# EAGLE design NOMIDI_Controller_001 (EAGLE 9.6.2)
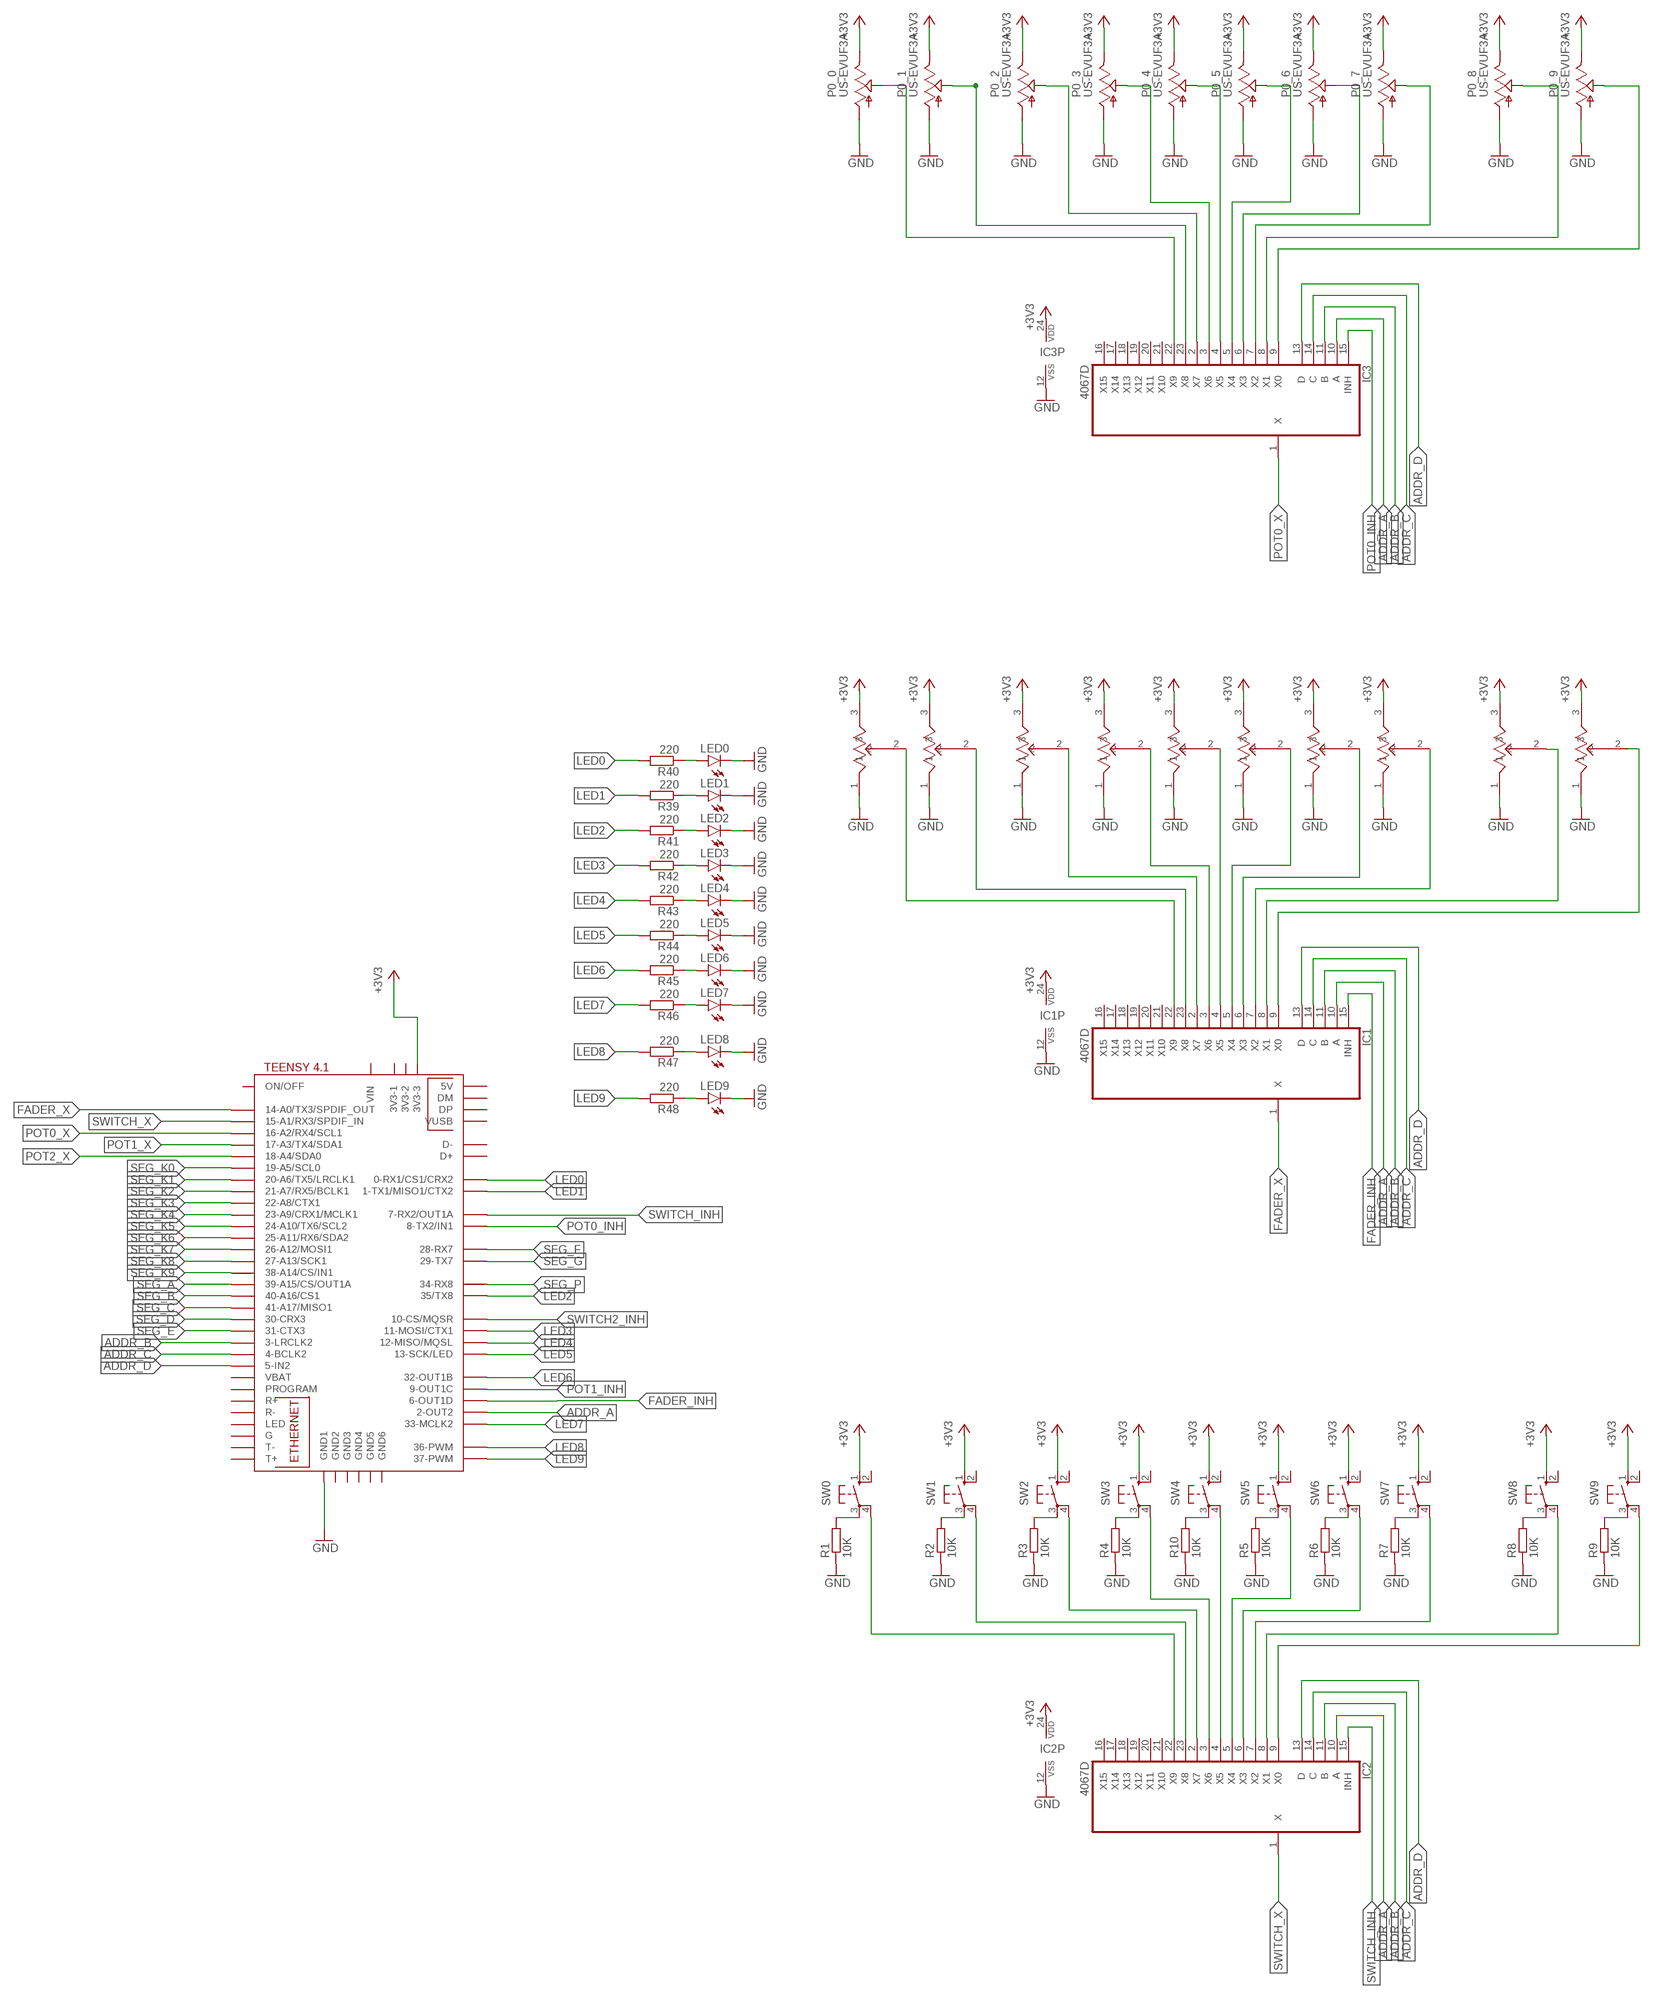
[diagram p0: schematic, sheet 1, part 1 of 3]
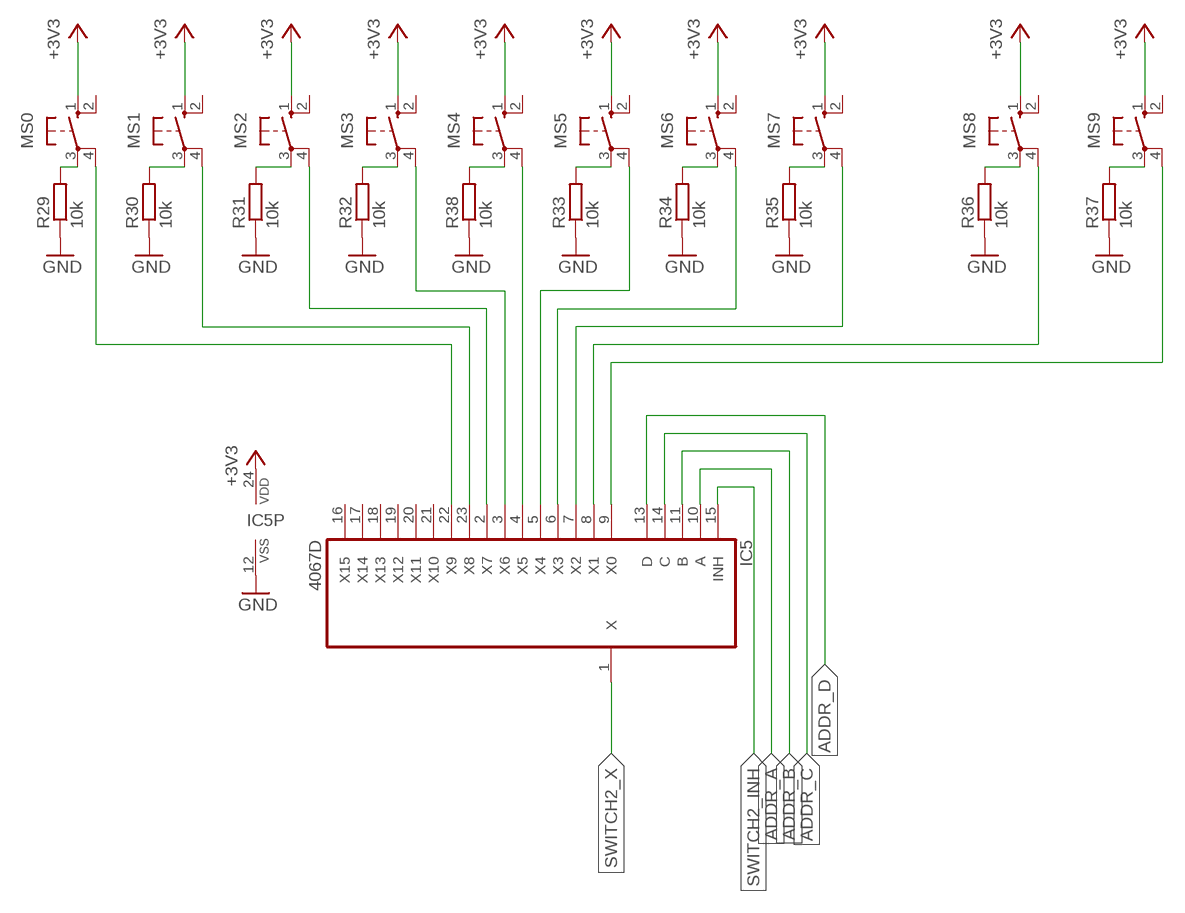
[diagram p1: schematic, sheet 1, part 2 of 3]
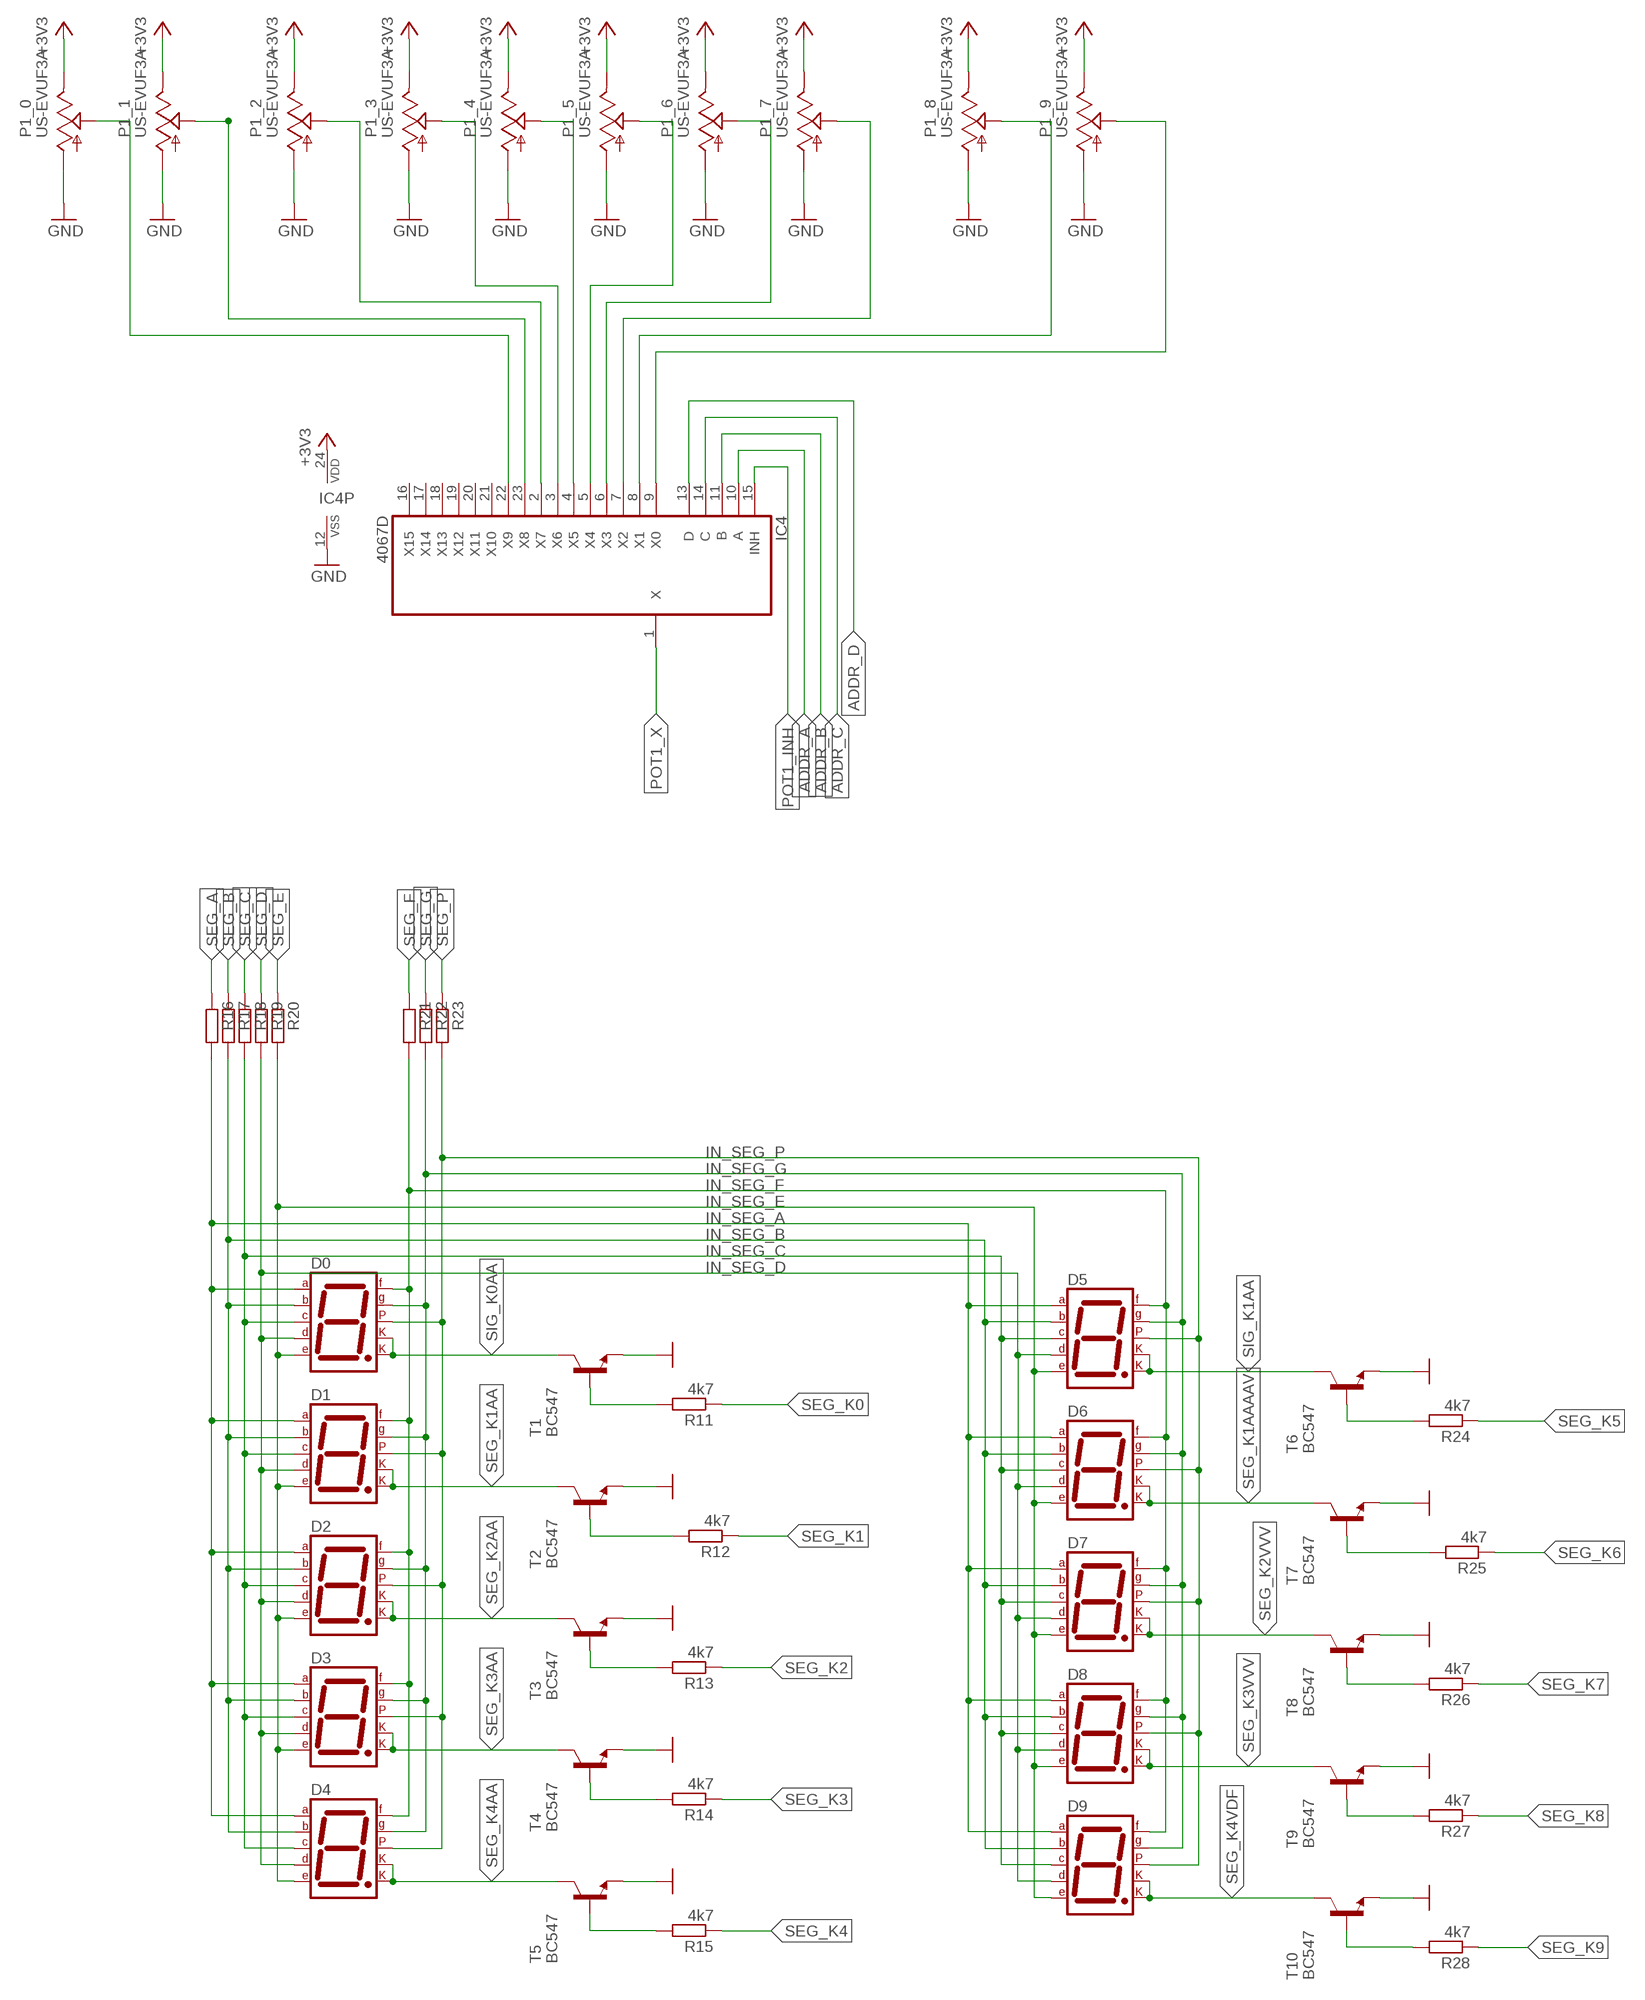
[diagram p2: schematic, sheet 1, part 3 of 3]

## Parts
D0  7SEG-CK  [7SEG-13]
D1  7SEG-CK  [7SEG-13]
D2  7SEG-CK  [7SEG-13]
D3  7SEG-CK  [7SEG-13]
D4  7SEG-CK  [7SEG-13]
D5  7SEG-CK  [7SEG-13]
D6  7SEG-CK  [7SEG-13]
D7  7SEG-CK  [7SEG-13]
D8  7SEG-CK  [7SEG-13]
D9  7SEG-CK  [7SEG-13]
IC1  4067D  [SO24W]
IC2  4067D  [SO24W]
IC3  4067D  [SO24W]
IC4  4067D  [SO24W]
IC5  4067D  [SO24W]
LED0  LED3MM  [LED3MM]
LED1  LED3MM  [LED3MM]
LED2  LED3MM  [LED3MM]
LED3  LED3MM  [LED3MM]
LED4  LED3MM  [LED3MM]
LED5  LED3MM  [LED3MM]
LED6  LED3MM  [LED3MM]
LED7  LED3MM  [LED3MM]
LED8  LED3MM  [LED3MM]
LED9  LED3MM  [LED3MM]
M0  SLIDEPOT-ALPS-60MM  [RS6011SP600]
M1  SLIDEPOT-ALPS-60MM  [RS6011SP600]
MS0  10-XX  [B3F-10XX]
MS1  10-XX  [B3F-10XX]
MS2  10-XX  [B3F-10XX]
MS3  10-XX  [B3F-10XX]
MS4  10-XX  [B3F-10XX]
MS5  10-XX  [B3F-10XX]
MS6  10-XX  [B3F-10XX]
MS7  10-XX  [B3F-10XX]
MS8  10-XX  [B3F-10XX]
MS9  10-XX  [B3F-10XX]
P0_0  US-EVUF3A  [EVUF]
P0_1  US-EVUF3A  [EVUF]
P0_2  US-EVUF3A  [EVUF]
P0_3  US-EVUF3A  [EVUF]
P0_4  US-EVUF3A  [EVUF]
P0_5  US-EVUF3A  [EVUF]
P0_6  US-EVUF3A  [EVUF]
P0_7  US-EVUF3A  [EVUF]
P0_8  US-EVUF3A  [EVUF]
P0_9  US-EVUF3A  [EVUF]
P1_0  US-EVUF3A  [EVUF]
P1_1  US-EVUF3A  [EVUF]
P1_2  US-EVUF3A  [EVUF]
P1_3  US-EVUF3A  [EVUF]
P1_4  US-EVUF3A  [EVUF]
P1_5  US-EVUF3A  [EVUF]
P1_6  US-EVUF3A  [EVUF]
P1_7  US-EVUF3A  [EVUF]
P1_8  US-EVUF3A  [EVUF]
P1_9  US-EVUF3A  [EVUF]
R1  10K  R-EU_0207/7  [0207/7]
R2  10K  R-EU_0207/7  [0207/7]
R3  10K  R-EU_0207/7  [0207/7]
R4  10K  R-EU_0207/7  [0207/7]
R5  10K  R-EU_0207/7  [0207/7]
R6  10K  R-EU_0207/7  [0207/7]
R7  10K  R-EU_0207/7  [0207/7]
R8  10K  R-EU_0207/7  [0207/7]
R9  10K  R-EU_0207/7  [0207/7]
R10  10K  R-EU_0207/7  [0207/7]
R11  4k7  R-EU_0207/7  [0207/7]
R12  4k7  R-EU_0207/7  [0207/7]
R13  4k7  R-EU_0207/7  [0207/7]
R14  4k7  R-EU_0207/7  [0207/7]
R15  4k7  R-EU_0207/7  [0207/7]
R16  R-EU_0207/7  [0207/7]
R17  R-EU_0207/7  [0207/7]
R18  R-EU_0207/7  [0207/7]
R19  R-EU_0207/7  [0207/7]
R20  R-EU_0207/7  [0207/7]
R21  R-EU_0207/7  [0207/7]
R22  R-EU_0207/7  [0207/7]
R23  R-EU_0207/7  [0207/7]
R24  4k7  R-EU_0207/7  [0207/7]
R25  4k7  R-EU_0207/7  [0207/7]
R26  4k7  R-EU_0207/7  [0207/7]
R27  4k7  R-EU_0207/7  [0207/7]
R28  4k7  R-EU_0207/7  [0207/7]
R29  10k  R-EU_0207/7  [0207/7]
R30  10k  R-EU_0207/7  [0207/7]
R31  10k  R-EU_0207/7  [0207/7]
R32  10k  R-EU_0207/7  [0207/7]
R33  10k  R-EU_0207/7  [0207/7]
R34  10k  R-EU_0207/7  [0207/7]
R35  10k  R-EU_0207/7  [0207/7]
R36  10k  R-EU_0207/7  [0207/7]
R37  10k  R-EU_0207/7  [0207/7]
R38  10k  R-EU_0207/7  [0207/7]
R39  220  R-EU_0207/7  [0207/7]
R40  220  R-EU_0207/7  [0207/7]
R41  220  R-EU_0207/7  [0207/7]
R42  220  R-EU_0207/7  [0207/7]
R43  220  R-EU_0207/7  [0207/7]
R44  220  R-EU_0207/7  [0207/7]
R45  220  R-EU_0207/7  [0207/7]
R46  220  R-EU_0207/7  [0207/7]
R47  220  R-EU_0207/7  [0207/7]
R48  220  R-EU_0207/7  [0207/7]
S0  SLIDEPOT-ALPS-60MM  [RS6011SP600]
S1  SLIDEPOT-ALPS-60MM  [RS6011SP600]
S2  SLIDEPOT-ALPS-60MM  [RS6011SP600]
S3  SLIDEPOT-ALPS-60MM  [RS6011SP600]
S4  SLIDEPOT-ALPS-60MM  [RS6011SP600]
S5  SLIDEPOT-ALPS-60MM  [RS6011SP600]
S6  SLIDEPOT-ALPS-60MM  [RS6011SP600]
S7  SLIDEPOT-ALPS-60MM  [RS6011SP600]
SW0  10-XX  [B3F-10XX]
SW1  10-XX  [B3F-10XX]
SW2  10-XX  [B3F-10XX]
SW3  10-XX  [B3F-10XX]
SW4  10-XX  [B3F-10XX]
SW5  10-XX  [B3F-10XX]
SW6  10-XX  [B3F-10XX]
SW7  10-XX  [B3F-10XX]
SW8  10-XX  [B3F-10XX]
SW9  10-XX  [B3F-10XX]
T1  BC547  [TO92]
T2  BC547  [TO92]
T3  BC547  [TO92]
T4  BC547  [TO92]
T5  BC547  [TO92]
T6  BC547  [TO92]
T7  BC547  [TO92]
T8  BC547  [TO92]
T9  BC547  [TO92]
T10  BC547  [TO92]
U$1  TEENSY41  [TEENSY41]

## Nets
+3V3: IC1.24(VDD) IC2.24(VDD) IC3.24(VDD) IC4.24(VDD) IC5.24(VDD) M0.3 M1.3 MS0.1(S) MS1.1(S) MS2.1(S) MS3.1(S) MS4.1(S) MS5.1(S) MS6.1(S) MS7.1(S) MS8.1(S) MS9.1(S) P0_0.3(E) P0_1.3(E) P0_2.3(E) P0_3.3(E) P0_4.3(E) P0_5.3(E) P0_6.3(E) P0_7.3(E) P0_8.3(E) P0_9.3(E) P1_0.3(E) P1_1.3(E) P1_2.3(E) P1_3.3(E) P1_4.3(E) P1_5.3(E) P1_6.3(E) P1_7.3(E) P1_8.3(E) P1_9.3(E) S0.3 S1.3 S2.3 S3.3 S4.3 S5.3 S6.3 S7.3 SW0.1(S) SW1.1(S) SW2.1(S) SW3.1(S) SW4.1(S) SW5.1(S) SW6.1(S) SW7.1(S) SW8.1(S) SW9.1(S) U$1.3V3-3
ADDR_A: IC1.10(A) IC2.10(A) IC3.10(A) IC4.10(A) IC5.10(A) U$1.2-OUT2
ADDR_B: IC1.11(B) IC2.11(B) IC3.11(B) IC4.11(B) IC5.11(B) U$1.3-LRCLK2
ADDR_C: IC1.14(C) IC2.14(C) IC3.14(C) IC4.14(C) IC5.14(C) U$1.4-BCLK2
ADDR_D: IC1.13(D) IC2.13(D) IC3.13(D) IC4.13(D) IC5.13(D) U$1.5-IN2
FADER_INH: IC1.15(INH) U$1.6-OUT1D
FADER_X: IC1.1(X) U$1.14-A0/TX3/SPDIF_OUT
GND: IC1.12(VSS) IC2.12(VSS) IC3.12(VSS) IC4.12(VSS) IC5.12(VSS) LED0.K(C) LED1.K(C) LED2.K(C) LED3.K(C) LED4.K(C) LED5.K(C) LED6.K(C) LED7.K(C) LED8.K(C) LED9.K(C) M0.1 M1.1 P0_0.1(A) P0_1.1(A) P0_2.1(A) P0_3.1(A) P0_4.1(A) P0_5.1(A) P0_6.1(A) P0_7.1(A) P0_8.1(A) P0_9.1(A) P1_0.1(A) P1_1.1(A) P1_2.1(A) P1_3.1(A) P1_4.1(A) P1_5.1(A) P1_6.1(A) P1_7.1(A) P1_8.1(A) P1_9.1(A) R1.1 R2.1 R3.1 R4.1 R5.1 R6.1 R7.1 R8.1 R9.1 R10.1 R29.1 R30.1 R31.1 R32.1 R33.1 R34.1 R35.1 R36.1 R37.1 R38.1 S0.1 S1.1 S2.1 S3.1 S4.1 S5.1 S6.1 S7.1 T1.1(E) T2.1(E) T3.1(E) T4.1(E) T5.1(E) T6.1(E) T7.1(E) T8.1(E) T9.1(E) T10.1(E) U$1.GND1
IN_SEG_A: D0.7(A) D1.7(A) D2.7(A) D3.7(A) D4.7(A) D5.7(A) D6.7(A) D7.7(A) D8.7(A) D9.7(A) R16.2
IN_SEG_B: D0.6(B) D1.6(B) D2.6(B) D3.6(B) D4.6(B) D5.6(B) D6.6(B) D7.6(B) D8.6(B) D9.6(B) R17.2
IN_SEG_C: D0.4(C) D1.4(C) D2.4(C) D3.4(C) D4.4(C) D5.4(C) D6.4(C) D7.4(C) D8.4(C) D9.4(C) R18.2
IN_SEG_D: D0.2(D) D1.2(D) D2.2(D) D3.2(D) D4.2(D) D5.2(D) D6.2(D) D7.2(D) D8.2(D) D9.2(D) R19.2
IN_SEG_E: D0.1(E) D1.1(E) D2.1(E) D3.1(E) D4.1(E) D5.1(E) D6.1(E) D7.1(E) D8.1(E) D9.1(E) R20.2
IN_SEG_F: D0.9(F) D1.9(F) D2.9(F) D3.9(F) D4.9(F) D5.9(F) D6.9(F) D7.9(F) D8.9(F) D9.9(F) R21.2
IN_SEG_G: D0.10(G) D1.10(G) D2.10(G) D3.10(G) D4.10(G) D5.10(G) D6.10(G) D7.10(G) D8.10(G) D9.10(G) R22.2
IN_SEG_P: D0.5(DP) D1.5(DP) D2.5(DP) D3.5(DP) D4.5(DP) D5.5(DP) D6.5(DP) D7.5(DP) D8.5(DP) D9.5(DP) R23.2
LED0: R40.2 U$1.0-RX1/CS1/CRX2
LED1: R39.2 U$1.1-TX1/MISO1/CTX2
LED2: R41.2 U$1.35-TX8(35/TX8)
LED3: R42.2 U$1.11-MOSI/CTX1
LED4: R43.2 U$1.12-MISO/MQSL
LED5: R44.2 U$1.13-SCK/LED
LED6: R45.2 U$1.32-OUT1B
LED7: R46.2 U$1.33-MCLK2
LED8: R47.2 U$1.36-PWM
LED9: R48.2 U$1.37-PWM
N$1: IC1.22(X9) S0.2
N$2: IC1.9(X0) M1.2
N$3: IC1.8(X1) M0.2
N$4: IC2.9(X0) SW9.4(P1)
N$5: IC1.7(X2) S7.2
N$6: IC1.6(X3) S6.2
N$7: IC1.5(X4) S5.2
N$8: IC1.4(X5) S4.2
N$9: IC1.3(X6) S3.2
N$10: IC1.2(X7) S2.2
N$11: IC1.23(X8) S1.2
N$12: IC2.8(X1) SW8.4(P1)
N$13: IC2.7(X2) SW7.4(P1)
N$14: IC2.6(X3) SW6.4(P1)
N$15: IC2.5(X4) SW5.4(P1)
N$16: IC3.9(X0) P0_9.2(S)
N$17: IC2.3(X6) SW3.4(P1)
N$18: IC2.2(X7) SW2.4(P1)
N$19: IC2.23(X8) SW1.4(P1)
N$20: IC2.22(X9) SW0.4(P1)
N$21: R1.2 SW0.3(P)
N$22: R2.2 SW1.3(P)
N$23: IC3.8(X1) P0_8.2(S)
N$24: R3.2 SW2.3(P)
N$25: IC3.7(X2) P0_7.2(S)
N$26: R4.2 SW3.3(P)
N$27: IC3.6(X3) P0_6.2(S)
N$28: R5.2 SW5.3(P)
N$29: IC3.5(X4) P0_5.2(S)
N$30: R6.2 SW6.3(P)
N$31: IC3.4(X5) P0_4.2(S)
N$32: R7.2 SW7.3(P)
N$33: IC3.3(X6) P0_3.2(S)
N$34: R8.2 SW8.3(P)
N$35: IC3.2(X7) P0_2.2(S)
N$36: R9.2 SW9.3(P)
N$37: IC2.4(X5) SW4.4(P1)
N$38: R10.2 SW4.3(P)
N$39: IC3.23(X8) P0_1.2(S)
N$40: IC3.22(X9) P0_0.2(S)
N$41: IC4.9(X0) P1_9.2(S)
N$42: IC4.8(X1) P1_8.2(S)
N$43: IC4.7(X2) P1_7.2(S)
N$44: IC4.6(X3) P1_6.2(S)
N$45: IC4.5(X4) P1_5.2(S)
N$46: IC4.4(X5) P1_4.2(S)
N$47: IC4.3(X6) P1_3.2(S)
N$48: IC4.2(X7) P1_2.2(S)
N$49: IC4.23(X8) P1_1.2(S)
N$50: IC4.22(X9) P1_0.2(S)
N$51: R11.2 T1.2(B)
N$52: R12.2 T2.2(B)
N$53: IC5.9(X0) MS9.4(P1)
N$54: R13.2 T3.2(B)
N$55: R14.2 T4.2(B)
N$56: R15.2 T5.2(B)
N$57: IC5.8(X1) MS8.4(P1)
N$58: IC5.7(X2) MS7.4(P1)
N$59: IC5.6(X3) MS6.4(P1)
N$60: IC5.5(X4) MS5.4(P1)
N$61: IC5.3(X6) MS3.4(P1)
N$62: IC5.2(X7) MS2.4(P1)
N$63: IC5.23(X8) MS1.4(P1)
N$64: R24.2 T6.2(B)
N$65: R25.2 T7.2(B)
N$66: R26.2 T8.2(B)
N$67: R27.2 T9.2(B)
N$68: R28.2 T10.2(B)
N$69: IC5.22(X9) MS0.4(P1)
N$70: MS0.3(P) R29.2
N$71: MS1.3(P) R30.2
N$72: MS2.3(P) R31.2
N$73: MS3.3(P) R32.2
N$74: MS5.3(P) R33.2
N$75: MS6.3(P) R34.2
N$76: MS7.3(P) R35.2
N$77: MS8.3(P) R36.2
N$78: MS9.3(P) R37.2
N$79: IC5.4(X5) MS4.4(P1)
N$80: MS4.3(P) R38.2
N$81: LED2.A R41.1
N$82: LED0.A R40.1
N$83: LED3.A R42.1
N$84: LED1.A R39.1
N$85: LED4.A R43.1
N$86: LED5.A R44.1
N$87: LED6.A R45.1
N$88: LED7.A R46.1
N$89: LED8.A R47.1
N$90: LED9.A R48.1
POT0_INH: IC3.15(INH) U$1.8-TX2/IN1
POT0_X: IC3.1(X) U$1.16-A2/RX4/SCL1
POT1_INH: IC4.15(INH) U$1.9-OUT1C
POT1_X: IC4.1(X) U$1.17-A3/TX4/SDA1
POT2_X: U$1.18-A4/SDA0
SEG_A: R16.1 U$1.39-A15/CS/OUT1A
SEG_B: R17.1 U$1.40-A16/CS1
SEG_C: R18.1 U$1.41-A17/MISO1
SEG_D: R19.1 U$1.30-CRX3
SEG_E: R20.1 U$1.31-CTX3
SEG_F: R21.1 U$1.28-RX7
SEG_G: R22.1 U$1.29-TX7
SEG_K0: R11.1 U$1.19-A5/SCL0
SEG_K1: R12.1 U$1.20-A6/TX5/LRCLK1
SEG_K1AA: D1.3(CK1) D1.8(CK2) T2.3(C)
SEG_K1AAAAV: D6.3(CK1) D6.8(CK2) T7.3(C)
SEG_K2: R13.1 U$1.21-A7/RX5/BCLK1
SEG_K2AA: D2.3(CK1) D2.8(CK2) T3.3(C)
SEG_K2VVV: D7.3(CK1) D7.8(CK2) T8.3(C)
SEG_K3: R14.1 U$1.22-A8/CTX1
SEG_K3AA: D3.3(CK1) D3.8(CK2) T4.3(C)
SEG_K3VVV: D8.3(CK1) D8.8(CK2) T9.3(C)
SEG_K4: R15.1 U$1.23-A9/CRX1/MCLK1
SEG_K4AA: D4.3(CK1) D4.8(CK2) T5.3(C)
SEG_K4VDF: D9.3(CK1) D9.8(CK2) T10.3(C)
SEG_K5: R24.1 U$1.24-A10/TX6/SCL2
SEG_K6: R25.1 U$1.25-A11/RX6/SDA2
SEG_K7: R26.1 U$1.26-A12/MOSI1
SEG_K8: R27.1 U$1.27-A13/SCK1
SEG_K9: R28.1 U$1.38-A14/CS/IN1
SEG_P: R23.1 U$1.34-RX8
SIG_K0AA: D0.3(CK1) D0.8(CK2) T1.3(C)
SIG_K1AA: D5.3(CK1) D5.8(CK2) T6.3(C)
SWITCH2_INH: IC5.15(INH) U$1.10-CS\MQSR(10-CS/MQSR)
SWITCH2_X: IC5.1(X)
SWITCH_INH: IC2.15(INH) U$1.7-RX2/OUT1A
SWITCH_X: IC2.1(X) U$1.15-A1/RX3/SPDIF_IN
Unconnected: IC1.16(X15) IC1.17(X14) IC1.18(X13) IC1.19(X12) IC1.20(X11) IC1.21(X10) IC2.16(X15) IC2.17(X14) IC2.18(X13) IC2.19(X12) IC2.20(X11) IC2.21(X10) IC3.16(X15) IC3.17(X14) IC3.18(X13) IC3.19(X12) IC3.20(X11) IC3.21(X10) IC4.16(X15) IC4.17(X14) IC4.18(X13) IC4.19(X12) IC4.20(X11) IC4.21(X10) IC5.16(X15) IC5.17(X14) IC5.18(X13) IC5.19(X12) IC5.20(X11) IC5.21(X10) MS0.2(S1) MS1.2(S1) MS2.2(S1) MS3.2(S1) MS4.2(S1) MS5.2(S1) MS6.2(S1) MS7.2(S1) MS8.2(S1) MS9.2(S1) SW0.2(S1) SW1.2(S1) SW2.2(S1) SW3.2(S1) SW4.2(S1) SW5.2(S1) SW6.2(S1) SW7.2(S1) SW8.2(S1) SW9.2(S1) U$1.3V3-1 U$1.3V3-2 U$1.+5V(5V) U$1.D+ U$1.D- U$1.DM U$1.DP U$1.G U$1.GND2 U$1.GND3 U$1.GND4 U$1.GND5 U$1.GND6 U$1.LED U$1.ON/OFF U$1.PROGRAM U$1.R+ U$1.R- U$1.T+ U$1.T- U$1.VBAT U$1.VIN U$1.VUSB

## Library data of the parts
D0 D1-D9 = special:7SEG-CK: 7-segment DISPLAY single cathode, 13 mm
IC1-IC5 = 40xx:4067: 16-channel ANALOG MULTIPLEXER
LED0 LED1-LED9 = led:LED: LED OSRAM: - CHIPLED LG R971, LG N971, LY N971, LG Q971, LY Q971, LO R971, LY R971 LH N974, LH R974 LS Q976, LO Q976, LY Q976 LO Q996 - Hyper CHIPLED LW Q18S LB Q993, LB Q99A, LB R99A - SideLED LS A670, LO A670, LY A670, LG A670, LP A670 LB A673, LV A673, LT A673, LW A673 LH A674 LY A675 LS A676, LA A676, LO A676, LY A676, LW A676 LS A679, LY A679, LG A679 - Hyper Micro SIDELED® LS Y876, LA Y876, LO Y876, LY Y876 LT Y87S - SmartLED LW L88C, LW L88S LB L89C, LB L89S, LG L890 LS L89K, LO L89K, LY L89K LS L896, LA L896, LO L896, LY L896 - TOPLED LS T670, LO T670, LY T670, LG T670, LP T670 LSG T670, LSP T670, LSY T670, LOP T670, LYG T670 LG T671, LOG T671, LSG T671 LB T673, LV T673, LT T673, LW T673 LH T674 LS T676, LA T676, LO T676, LY T676, LB T676, LH T676, LSB T676, LW T676 LB T67C, LV T67C, LT T67C, LS T67K, LO T67K, LY T67K, LW E67C LS E67B, LA E67B, LO E67B, LY E67B, LB E67C, LV E67C, LT E67C LW T67C LS T679, LY T679, LG T679 LS T770, LO T770, LY T770, LG T770, LP T770 LB T773, LV T773, LT T773, LW T773 LH T774 LS E675, LA E675, LY E675, LS T675 LS T776, LA T776, LO T776, LY T776, LB T776 LHGB T686 LT T68C, LB T68C - Hyper Mini TOPLED® LB M676 - Mini TOPLED Santana® LG M470 LS M47K, LO M47K, LY M47K Source: http://www.osram.convergy.de LUXEON: - LUMILED® LXK2-PW12-R00, LXK2-PW12-S00, LXK2-PW14-U00, LXK2-PW14-V00 LXK2-PM12-R00, LXK2-PM12-S00, LXK2-PM14-U00 LXK2-PE12-Q00, LXK2-PE12-R00, LXK2-PE12-S00, LXK2-PE14-T00, LXK2-PE14-U00 LXK2-PB12-K00, LXK2-PB12-L00, LXK2-PB12-M00, LXK2-PB14-N00, LXK2-PB14-P00, LXK2-PB14-Q00 LXK2-PR12-L00, LXK2-PR12-M00, LXK2-PR14-Q00, LXK2-PR14-R00 LXK2-PD12-Q00, LXK2-PD12-R00, LXK2-PD12-S00 LXK2-PH12-R00, LXK2-PH12-S00 LXK2-PL12-P00, LXK2-PL12-Q00, LXK2-PL12-R00 Source: www.luxeon.com KINGBRIGHT: KA-3528ASYC Source: www.kingbright.com
M0 M1 S0 S1-S7 = monome:SLIDEPOT-ALPS-60MM
MS0 MS1-MS9 SW0 SW1-SW9 = switch-omron:10-XX: OMRON SWITCH; MPN: B3F-1000; OC_FARNELL: 176432; OC_NEWARK: 36M3542
P0_0 P0_1-P0_9 P1_0 P1_1-P1_9 = pot:US-EVU: 9 mm Square Rotary Potentiometers Source: Panasonic
R1-R48 = rcl:R-EU_: RESISTOR, European symbol; SPICEPREFIX: R
T1-T10 = transistor-neu-to92:BC547: NPN TRANSISTOR
U$1 = teensy:TEENSY41

## Board
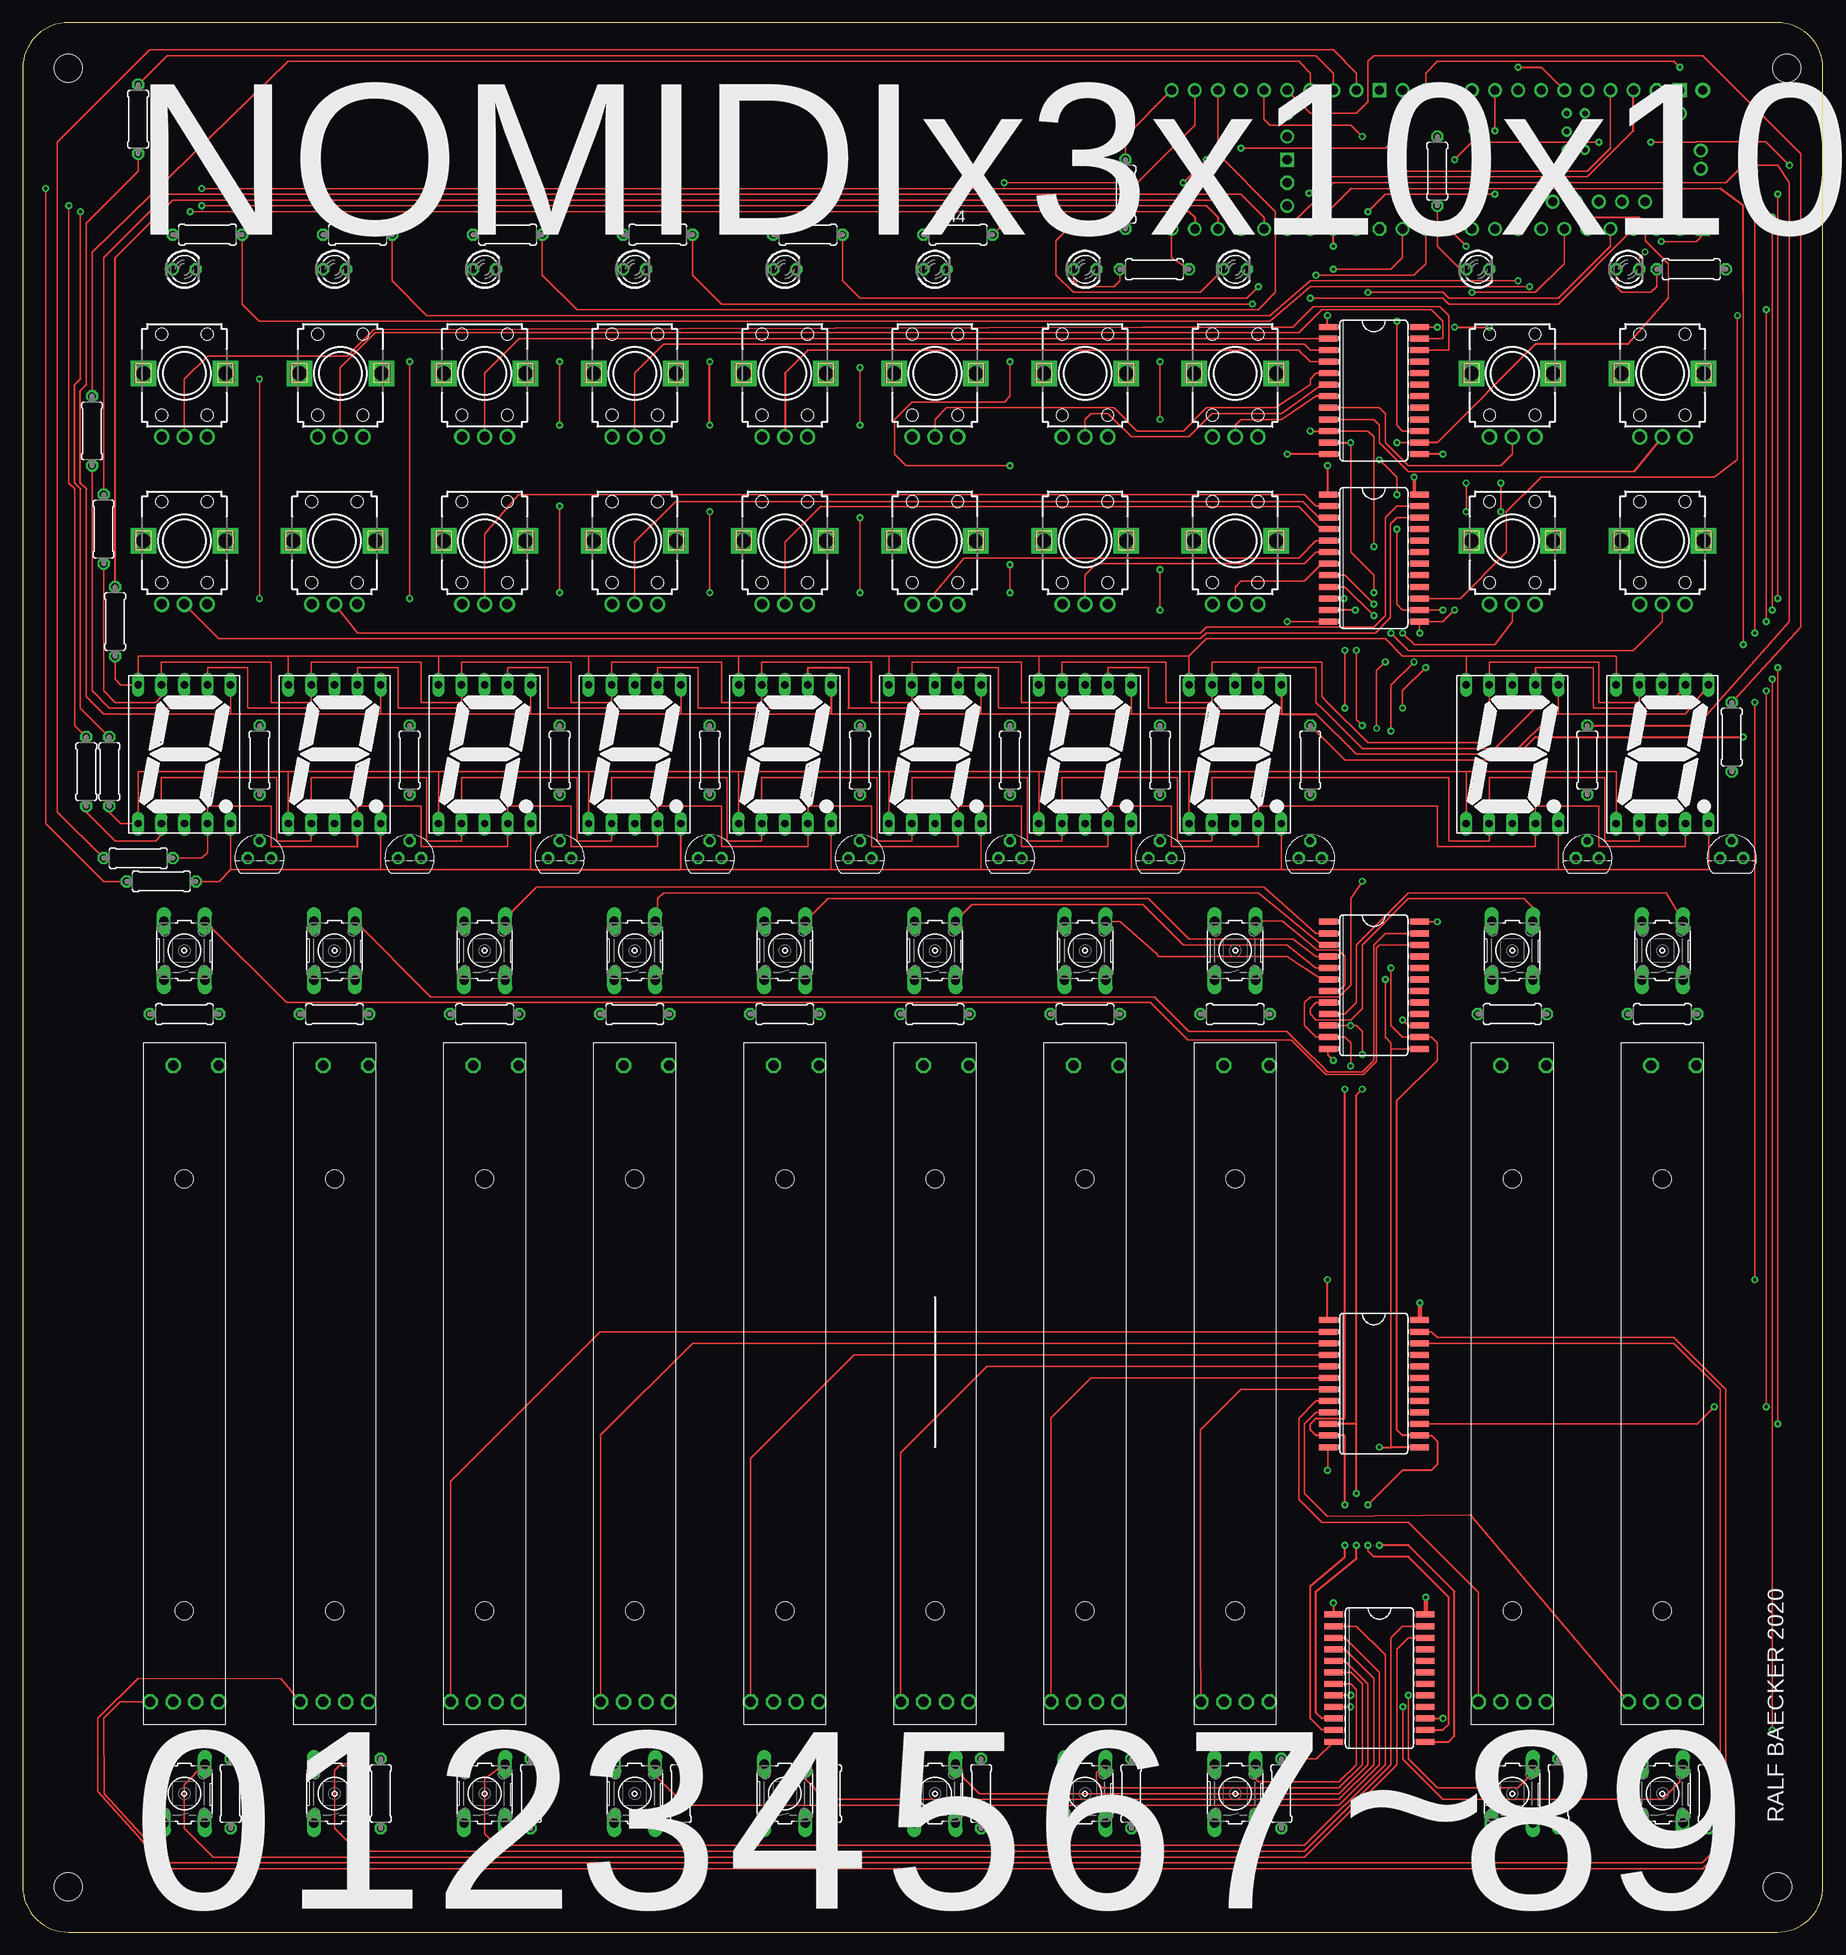
[diagram p3: board, top side]
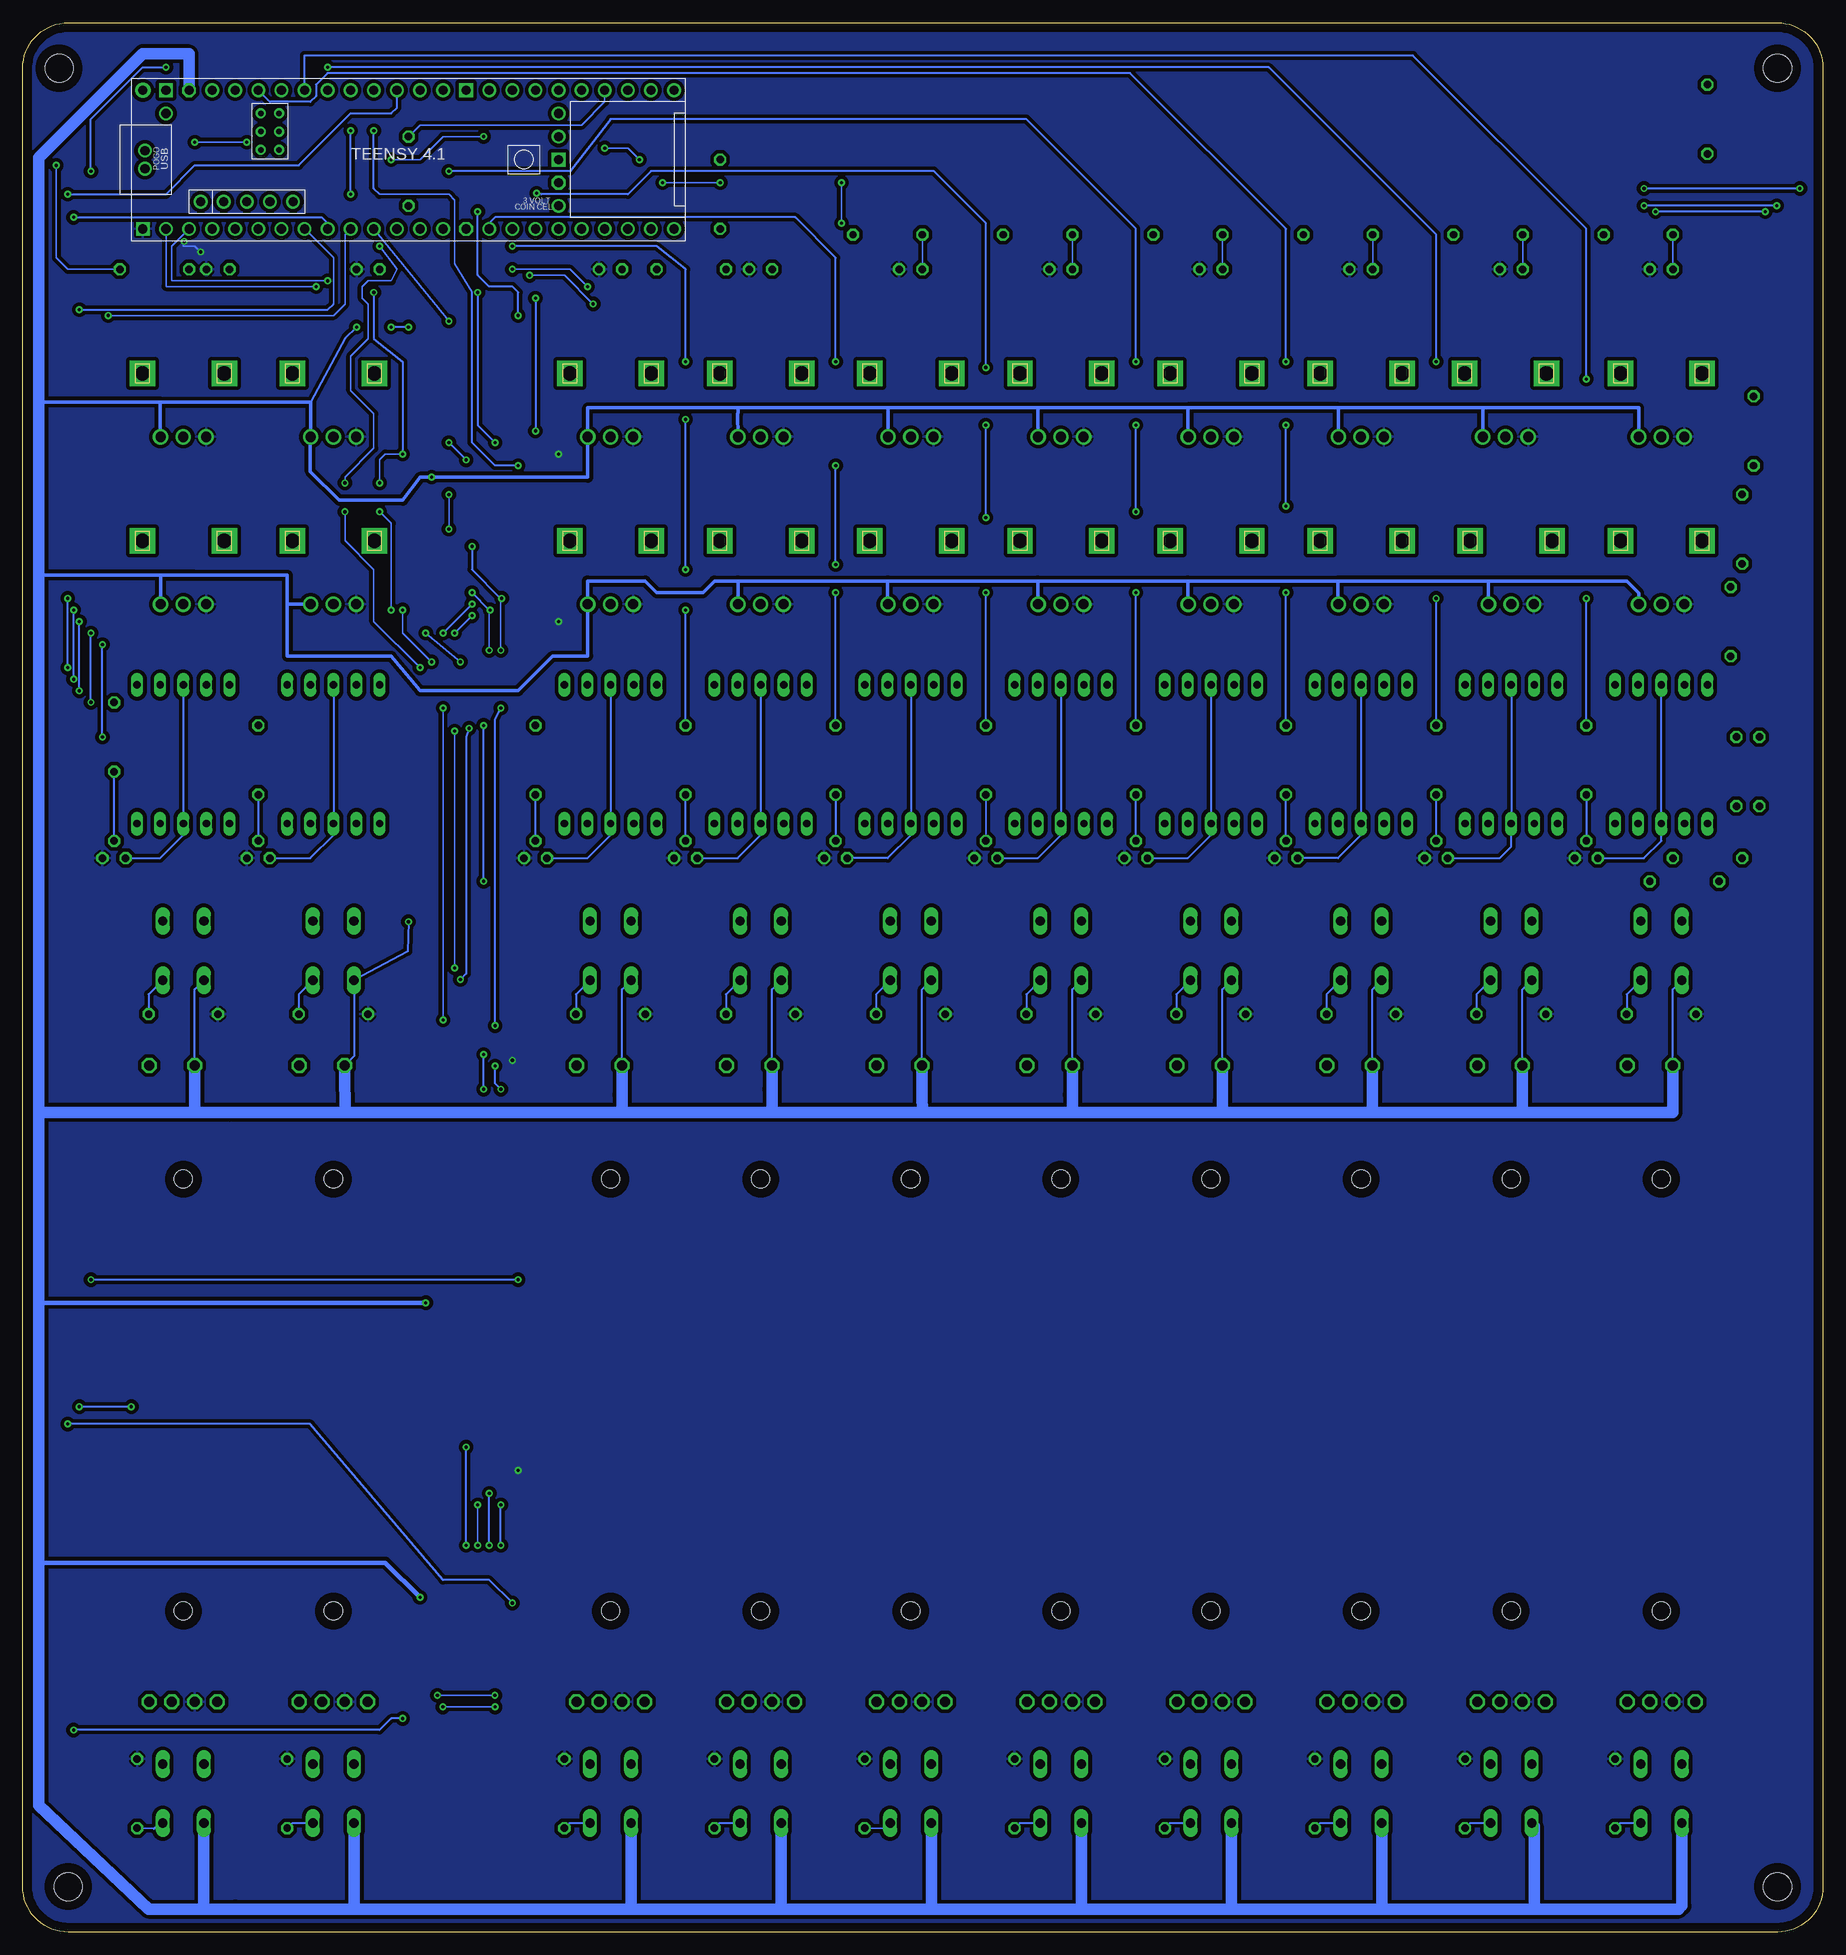
[diagram p4: board, bottom side, seen from below]

Size 198 x 210 mm. Coordinates in mm from the lower left corner, seen from the top.
Outline: 193,210 5,210 arc90 0,205 0,5 arc90 5,0 193,0 arc90 198,5 198,205 arc90 193,210
Copper layers (1*16): Top 0.035mm / dielectric 1.5mm / Bottom 0.035mm
Design rules "default": minimum track width 6mil, minimum drill 0.35mm, track to track 6mil, track to pad 6mil, pad to pad 6mil, via to via 6mil, smd to smd 6mil, copper to edge 40mil, drill to drill 6mil, minimum pad ring 10mil, minimum via ring 8mil, stop-mask expansion 4mil, vias tented up to drill 0mil, thermal gap 10mil
Holes 3.1 mm at 5,5 193,5 5,205 194,205

### Footprints (pad centres in the part's own frame; a part is rotated, then mirrored left to right if it is on the bottom)
7SEG-13 = drill 0.813 long: 1 -5.08,-7.62; 2 -2.54,-7.62; 3 0,-7.62; 4 2.54,-7.62; 5 5.08,-7.62; 6 5.08,7.62; 7 2.54,7.62; 8 0,7.62; 9 -2.54,7.62; 10 -5.08,7.62
SO24W = smd 0.66 x 2.032: 1 -6.985,-5.029; 2 -5.715,-5.029; 3 -4.445,-5.029; 4 -3.175,-5.029; 5 -1.905,-5.029; 6 -0.635,-5.029; 7 0.635,-5.029; 8 1.905,-5.029; 9 3.175,-5.029; 10 4.445,-5.029; 11 5.715,-5.029; 12 6.985,-5.029; 13 6.985,5.029; 14 5.715,5.029; 15 4.445,5.029; 16 3.175,5.029; 17 1.905,5.029; 18 0.635,5.029; 19 -0.635,5.029; 20 -1.905,5.029; 21 -3.175,5.029; 22 -4.445,5.029; 23 -5.715,5.029; 24 -6.985,5.029
LED3MM = drill 0.813 octagon: A -1.27,0; K 1.27,0
RS6011SP600 = drill 1.1 octagon: 1 -35,1.25; 2 -35,3.75; 3 35,1.25; L1 35,-3.75; L2 -35,-3.75; L3 -35,-1.25 | hole 2: -25,0; 22.5,0
B3F-10XX = drill 1.016 long: 1 -3.251,2.261; 2 3.251,2.261; 3 -3.251,-2.261; 4 3.251,-2.261
EVUF = drill 1.1 pad 1.676: 1 -2.5,-7; 2 0,-7; 3 2.5,-7 | drill 1.6 pad 2.8 square: M1 4.5,0; M2 -4.5,0
0207/7 = drill 0.813 octagon: 1 -3.81,0; 2 3.81,0
TO92 = drill 0.813 octagon: 1 1.27,0; 2 0,1.905; 3 -1.27,0
TEENSY41 = drill 1: 0-RX1/CS1/CRX2 -27.94,-7.62; 1-TX1/MISO1/CTX2 -25.4,-7.62; 2-OUT2 -22.86,-7.62; 3-LRCLK2 -20.32,-7.62; 4-BCLK2 -17.78,-7.62; 5-IN2 -15.24,-7.62; 6-OUT1D -12.7,-7.62; 7-RX2/OUT1A -10.16,-7.62; 8-TX2/IN1 -7.62,-7.62; 9-OUT1C -5.08,-7.62; 10-CS\MQSR -2.54,-7.62; 11-MOSI/CTX1 0,-7.62; 12-MISO/MQSL 2.54,-7.62; 13-SCK/LED 2.54,7.62; 14-A0/TX3/SPDIF_OUT 0,7.62; 15-A1/RX3/SPDIF_IN -2.54,7.62; 16-A2/RX4/SCL1 -5.08,7.62; 17-A3/TX4/SDA1 -7.62,7.62; 18-A4/SDA0 -10.16,7.62; 19-A5/SCL0 -12.7,7.62; 20-A6/TX5/LRCLK1 -15.24,7.62; 21-A7/RX5/BCLK1 -17.78,7.62; 22-A8/CTX1 -20.32,7.62; 23-A9/CRX1/MCLK1 -22.86,7.62; 24-A10/TX6/SCL2 7.62,-7.62; 25-A11/RX6/SDA2 10.16,-7.62; 26-A12/MOSI1 12.7,-7.62; 27-A13/SCK1 15.24,-7.62; 28-RX7 17.78,-7.62; 29-TX7 20.32,-7.62; 30-CRX3 22.86,-7.62; 31-CTX3 25.4,-7.62; 32-OUT1B 27.94,-7.62; 33-MCLK2 27.94,7.62; 34-RX8 25.4,7.62; 35-TX8 22.86,7.62; 36-PWM 20.32,7.62; 37-PWM 17.78,7.62; 38-A14/CS/IN1 15.24,7.62; 39-A15/CS/OUT1A 12.7,7.62; 40-A16/CS1 10.16,7.62; 41-A17/MISO1 7.62,7.62; +5V -24.13,-4.62; D+ -30.25,-1; D- -30.25,1; DM -21.59,-4.62; DP -19.05,-4.62; GND4 -16.51,-4.62; GND5 -13.97,-4.62; ON/OFF 15.24,5.08; PROGRAM 15.24,2.54; VBAT 15.24,-5.08; VUSB -27.94,5.08 | drill 1 octagon: 3V3-1 5.08,-7.62; 3V3-2 15.24,-2.54; 3V3-3 -25.4,7.62 | drill 0.6: G -15.51,3.08; LED -17.51,3.08; R+ -17.51,5.08; R- -15.51,5.08; T+ -15.51,1.08; T- -17.51,1.08 | drill 1 square: GND1 -30.48,-7.62; GND2 15.24,0; GND3 5.08,7.62; GND6 -27.94,7.62 | drill 1 pad 1.676: VIN -30.48,7.62

### Placement (x,y rotation side)
D0  17.78,129.54 0 top
D1  34.29,129.54 0 top
D2  50.8,129.54 0 top
D3  67.31,129.54 0 top
D4  83.82,129.54 0 top
D5  100.33,129.54 0 top
D6  116.84,129.54 0 top
D7  133.35,129.54 0 top
D8  163.83,129.54 0 top
D9  180.34,129.54 0 top
IC1  148.59,60.33 270 top
IC2  149.22,27.94 270 top
IC3  148.59,151.13 270 top
IC4  148.59,169.54 270 top
IC5  148.59,104.14 270 top
LED0  17.78,182.88 0 top
LED1  34.29,182.88 0 top
LED2  50.8,182.88 0 top
LED3  67.31,182.88 0 top
LED4  83.82,182.88 0 top
LED5  100.33,182.88 0 top
LED6  116.84,182.88 0 top
LED7  133.35,182.88 0 top
LED8  160.02,182.88 0 top
LED9  176.53,182.88 0 top
M0  163.83,60.33 90 top
M1  180.34,60.33 90 top
MS0  17.78,107.95 90 top
MS1  34.29,107.95 90 top
MS2  50.8,107.95 90 top
MS3  67.31,107.95 90 top
MS4  83.82,107.95 90 top
MS5  100.33,107.95 90 top
MS6  116.84,107.95 90 top
MS7  133.35,107.95 90 top
MS8  163.83,107.95 90 top
MS9  180.34,107.95 90 top
P0_0  17.78,153.03 0 top
P0_1  34.29,153.03 0 top
P0_2  50.8,153.03 0 top
P0_3  67.31,153.03 0 top
P0_4  83.82,153.03 0 top
P0_5  100.33,153.03 0 top
P0_6  116.84,153.03 0 top
P0_7  133.35,153.03 0 top
P0_8  163.83,153.03 0 top
P0_9  180.34,153.03 0 top
P1_0  17.78,171.45 0 top
P1_1  34.92,171.45 0 top
P1_2  50.8,171.45 0 top
P1_3  67.31,171.45 0 top
P1_4  83.82,171.45 0 top
P1_5  100.33,171.45 0 top
P1_6  116.84,171.45 0 top
P1_7  133.35,171.45 0 top
P1_8  163.83,171.45 0 top
P1_9  180.34,171.45 0 top
R1  22.86,15.24 270 top
R2  39.37,15.24 270 top
R3  55.88,15.24 270 top
R4  72.39,15.24 270 top
R5  105.41,15.24 270 top
R6  121.92,15.24 270 top
R7  138.43,15.24 270 top
R8  168.91,15.24 270 top
R9  185.42,15.24 270 top
R10  88.9,15.24 270 top
R11  26.04,128.91 270 top
R12  42.55,128.91 270 top
R13  59.05,128.91 270 top
R14  75.56,128.91 270 top
R15  92.08,128.91 270 top
R16  7.62,165.1 270 top
R17  12.7,199.39 270 top
R18  12.7,118.11 0 top
R19  6.99,127.64 270 top
R20  9.53,127.64 270 top
R21  8.89,154.31 270 top
R22  10.16,144.15 270 top
R23  15.24,115.57 0 top
R24  108.58,128.91 270 top
R25  125.09,128.91 270 top
R26  141.6,128.91 270 top
R27  172.09,128.91 270 top
R28  187.96,131.44 270 top
R29  17.78,100.97 0 top
R30  34.29,100.97 0 top
R31  50.8,100.97 0 top
R32  67.31,100.97 0 top
R33  100.33,100.97 0 top
R34  116.84,100.97 0 top
R35  133.35,100.97 0 top
R36  163.83,100.97 0 top
R37  180.34,100.97 0 top
R38  83.82,100.97 0 top
R39  36.83,186.69 0 top
R40  20.32,186.69 0 top
R41  53.34,186.69 0 top
R42  69.85,186.69 0 top
R43  86.36,186.69 0 top
R44  102.87,186.69 0 top
R45  124.46,182.88 0 top
R46  121.28,191.13 90 top
R47  155.57,193.68 90 top
R48  183.51,182.88 0 top
S0  17.78,60.33 90 top
S1  34.29,60.33 90 top
S2  50.8,60.33 90 top
S3  67.31,60.33 90 top
S4  83.82,60.33 90 top
S5  100.33,60.33 90 top
S6  116.84,60.33 90 top
S7  133.35,60.33 90 top
SW0  17.78,15.24 90 top
SW1  34.29,15.24 90 top
SW2  50.8,15.24 90 top
SW3  67.31,15.24 90 top
SW4  83.82,15.24 90 top
SW5  100.33,15.24 90 top
SW6  116.84,15.24 90 top
SW7  133.35,15.24 90 top
SW8  163.83,15.24 90 top
SW9  180.34,15.24 90 top
T1  26.04,118.11 0 top
T2  42.55,118.11 0 top
T3  59.05,118.11 0 top
T4  75.56,118.11 0 top
T5  92.08,118.11 0 top
T6  108.58,118.11 0 top
T7  125.09,118.11 0 top
T8  141.6,118.11 0 top
T9  172.09,118.11 0 top
T10  187.96,118.11 0 top
U$1  154.31,194.94 0 bottom

### Tracks (layer width: path | path; a pad name or v marks a point on that pad's centre or on a via)
+3V3  (via drill 0.35)
  Top 0.152: IC4.24 v155.57,176.53
  Top 0.2: IC5.24 v155.57,111.12 | v157.48,176.53 v161.29,176.53
  Top 0.406: IC3.24 153.03,158.12 v153.03,160.02
  Top 0.508: IC2.24 154.31,34.98 v154.31,36.83 | IC1.24 153.67,67.36 v153.67,69.22
  Bottom 0.2: S0.3 16.53,103.69 MS0.1 | S1.3 33.04,103.69 MS1.1 | S2.3 49.55,103.69 MS2.1 | S3.3 66.06,103.69 MS3.1 | S4.3 82.57,103.69 MS4.1 | S5.3 99.08,103.69 MS5.1 | S6.3 115.59,103.69 MS6.1 | S7.3 132.1,103.69 MS7.1 | M1.3 179.09,103.69 MS9.1 | v155.57,111.12 155.65,107.87 MS8.1 161.57,96.34 M0.3 | v155.57,176.53 v157.48,176.53 | v161.29,176.53 162.52,175.3 166.33,168.28
  Bottom 0.406: P0_0.3 20.28,147.28 21.59,148.59 36.83,148.59 | 36.83,148.59 36.83,146.07 P0_1.3 | 36.83,148.59 53.34,148.59 | 53.34,148.59 53.34,146.07 P0_2.3 | P0_9.3 182.84,149.19 | 182.84,149.19 179.07,149.22 196.22,149.22 | 182.84,149.19 178.99,149.22 168.91,149.22 168.91,146.05 | 168.91,146.05 168.91,140.34 157.48,140.34 154.31,136.53 143.51,136.53 139.7,140.34 135.89,140.34 135.85,140.38 P0_7.3 135.85,148.55 135.89,148.59 129.54,148.59 128.27,147.32 123.19,147.32 121.92,148.59 119.38,148.59 | 119.38,148.59 102.87,148.59 | 102.87,148.59 86.36,148.59 | 86.36,148.59 69.85,148.59 | 69.85,148.59 53.34,148.59 | P0_4.3 86.36,146.07 86.36,148.59 | P0_3.3 69.85,146.07 69.85,148.59 | P0_6.3 119.34,148.55 119.38,148.59 | P1_9.3 182.88,165.12 182.88,168.28 | 182.88,168.28 196.22,168.28 | 182.88,168.28 166.33,168.28 166.33,164.47 | 166.33,164.47 P1_8.3 | P1_0.3 20.28,167.64 37.42,167.64 | P1_1.3 37.42,167.64 | P1_2.3 53.3,167.64 | 53.3,167.64 37.42,167.64 | 53.3,167.64 69.85,167.64 | P1_3.3 69.85,164.45 69.85,167.64 | P1_4.3 86.32,167.64 | 86.32,167.64 69.85,167.64 | P1_5.3 102.83,167.64 | 102.83,167.64 86.32,167.64 | P1_6.3 119.38,167 119.34,167.04 119.34,167.6 | 102.83,167.64 119.34,167.64 119.34,167.6 | 119.34,167.6 119.38,167.64 135.85,167.64 P1_7.3 135.85,160.02 v153.03,160.02 154.31,160.02 156.21,157.48 163.19,157.48 166.37,160.66 166.37,164.47 166.33,164.47 | P0_5.3 102.87,146.07 102.87,148.59 | P0_8.3 168.88,146.05 168.91,146.05
  Bottom 0.508: 15.88,2.54 15.52,2.9 | SW1.1 31.75,11.63 | 48.54,2.82 48.26,2.54 | 65.05,2.82 64.77,2.54 | 81.56,2.82 81.28,2.54 | 98.07,2.9 98.42,2.54 | 114.58,2.9 114.94,2.54 | 131.09,2.9 131.44,2.54 | 161.57,2.9 161.93,2.54 | 178.08,2.9 174.62,2.54 | v154.31,36.83 158.12,40.64 196.22,40.64 | v153.67,69.22 196.22,69.22
  Bottom 1.27: 31.75,2.54 48.26,2.54 64.77,2.54 81.28,2.54 98.42,2.54 114.94,2.54 131.44,2.54 161.93,2.54 174.62,2.54 184.15,2.54 196.22,13.97 196.22,40.64 196.22,69.22 196.22,90.17 | 31.75,2.54 15.88,2.54 | 15.52,2.9 SW0.1 | 196.22,90.17 196.22,149.22 196.22,168.28 196.22,195.17 184.8,206.59 179.71,206.59 U$1.3V3-3 | 31.75,11.63 31.75,2.54 | SW2.1 48.54,2.82 | SW3.1 65.05,2.82 | SW4.1 81.56,2.82 | SW5.1 98.07,2.9 | SW6.1 114.58,2.9 | SW7.1 131.09,2.9 | SW8.1 161.57,2.9 | SW9.1 178.08,2.9 | 33.02,90.17 16.51,90.17 16.53,90.19 S0.3 | 33.02,90.17 49.53,90.17 | 49.53,90.17 66.04,90.17 | 66.04,90.17 82.55,90.17 | 82.55,90.17 99.06,90.17 | 99.06,90.17 115.57,90.17 | 115.57,90.17 132.08,90.17 | 132.08,90.17 162.56,90.17 | 162.56,90.17 175.26,90.17 | 175.26,90.17 179.09,90.19 M1.3 | M0.3 162.58,94.64 162.56,90.17 | S7.3 132.1,92.09 132.08,90.17 | S6.3 115.59,92.73 115.57,90.17 | S1.3 33.04,90.19 33.02,90.17 | S2.3 49.55,90.19 49.53,90.17 | S3.3 66.06,91.46 66.04,90.17 | S4.3 82.57,92.09 82.55,90.17 | S5.3 99.08,92.09 99.06,90.17 | 175.26,90.17 196.22,90.17
ADDR_A  (via drill 0.35)
  Top 0.152: v147.32,96.52 147.32,99.06 146.69,99.69 v146.05,99.69 IC5.10 | U$1.2-OUT2 168.91,179.07 156.84,179.07 156.21,179.71 v141.6,179.71 | IC4.10 147.96,165.1 148.59,164.47 v148.59,152.4 | v145.41,134.62 v145.41,140.97
  Top 0.2: IC2.10 142.88,23.5 142.24,24.13 142.24,37.47 146.69,41.12 v146.69,42.55 | v146.69,48.26 146.69,55.88 | 146.69,55.88 IC1.10 | 146.69,55.88 146.69,92.08 v147.32,92.71 | v141.6,165.1 IC4.10 | v145.32,146.69 IC3.10
  Bottom 0.152: v145.41,140.97 145.41,146.69
  Bottom 0.2: v146.69,42.55 v146.69,48.26 | v147.32,92.71 v147.32,96.52 | v141.6,179.71 v141.6,165.1 | v148.59,152.4 148.59,149.86 145.41,146.69 v145.32,146.69 | v146.05,99.69 146.05,133.35 v145.41,134.62
ADDR_B  (via drill 0.35)
  Top 0.152: v146.05,95.25 146.05,97.79 145.41,98.42 IC5.11 142.24,98.42 140.97,99.69 140.97,102.23 141.6,102.87 144.78,102.87 146.05,104.14 146.05,113.67 v147.32,115.57 | v147.96,180.34 156.21,180.34 156.84,179.71 168.91,179.71 174.62,185.42 U$1.3-LRCLK2 | v148.59,147.32 148.59,149.22 146.05,151.76 v146.05,163.83 | v146.69,140.97 146.69,133.35 v147.32,132.72
  Top 0.2: IC2.11 142.88,22.23 141.6,23.5 141.6,38.1 145.41,41.27 v145.41,42.55 | v145.41,46.99 145.41,54.61 IC1.11 142.24,54.61 141.6,55.24 141.6,55.88 142.24,56.52 145.41,56.52 v145.41,92.71 | IC4.11 v146.05,163.83 | v146.59,145.41 IC3.11
  Bottom 0.152: v148.59,147.32 146.69,145.41 v146.69,140.97
  Bottom 0.2: v145.41,42.55 v145.41,46.99 | v145.41,92.71 146.05,93.34 v146.05,95.25 | v147.96,180.34 147.96,165.74 v146.05,163.83 | 146.69,145.41 v146.59,145.41 | v147.32,115.57 v147.32,132.72
ADDR_C  (via drill 0.35)
  Top 0.152: 151.13,91.44 155.57,95.89 155.57,97.79 154.94,98.42 IC5.14 151.76,98.42 150.5,99.69 v150.5,106.05 | U$1.4-BCLK2 172.09,187.96 172.72,188.59 | 177.8,188.59 178.44,187.96 178.44,186.06 180.97,183.51 180.97,179.71 176.53,174.62 | v150.5,132.08 150.5,137.16 v153.03,139.7 | v156.21,145.41 IC3.14 151.76,145.41 151.13,146.05 v151.13,154.31 | v151.13,158.12 151.13,160.02 v149.22,161.93 | v151.13,163.83 IC4.14 | 147.96,41.91 147.95,41.91 v147.95,42.53
  Top 0.2: IC2.14 156.21,22.23 156.84,22.86 156.84,36.83 152.4,41.27 148.59,41.27 147.96,41.91 | v147.96,46.99 151.76,50.8 154.94,50.8 155.57,51.44 155.57,53.98 154.94,54.61 IC1.14 151.76,54.61 151.13,55.24 151.13,91.44 | 172.72,188.59 177.8,188.59 | 176.53,174.62 166.37,174.62 155.57,163.83 IC4.14
  Bottom 0.152: v150.5,106.05 v150.5,132.08 | v153.03,139.7 156.21,142.88 v156.21,145.41 | v151.13,154.31 v151.13,158.12 | v149.22,161.93 v151.13,163.83 | v147.95,42.53 v147.95,46.99 v147.96,46.99
ADDR_D  (via drill 0.35)
  Top 0.152: 150.5,53.34 150.5,97.16 | U$1.5-IN2 169.54,183.51 166.37,180.34 v159.38,180.34 | v148.91,132.4 148.91,138.75 v149.86,139.7 | v153.67,142.88 153.62,142.93 IC3.13 156.21,144.15 v157.48,145.41 | v158.75,156.21 v158.75,159.38 | IC5.13 150.5,97.16 | 150.5,97.16 150.5,97.79 149.86,98.42 v149.86,104.78
  Top 0.2: IC2.13 156.84,20.95 157.48,21.59 157.48,37.47 152.4,42.55 v149.22,42.55 | v149.22,53.34 150.5,53.34 IC1.13 | v156.21,162.56 IC4.13
  Bottom 0.152: v149.86,139.7 v153.67,142.88 | v157.48,145.41 157.48,154.94 v158.75,156.21 | v156.21,162.56 158.12,162.56 158.75,161.93 v158.75,159.38
  Bottom 0.2: v149.22,42.55 v149.22,53.34 | v159.38,180.34 159.38,175.26 156.21,172.72 v156.21,162.56 | v148.91,132.4 149.22,131.44 149.22,105.41 v149.86,104.78
FADER_INH  (via drill 0.35)
  Top 0.152: IC1.15 184.15,55.88 | v191.77,57.78 v191.77,136.53 | v191.77,144.15 v191.77,178.44
  Top 0.2: 184.15,55.88 v186.06,57.78
  Bottom 0.152: 163.83,179.07 163.83,184.15 U$1.6-OUT1D
  Bottom 0.2: v186.06,57.78 v191.77,57.78 | v191.77,136.53 v191.77,144.15 | v191.77,178.44 164.47,178.44 163.83,179.07
FADER_X  (via drill 0.35)
  Top 0.152: v190.5,71.75 v190.5,135.25 | v182.25,205.1 181.61,205.74 155.57,205.74 154.31,204.47 U$1.14-A0/TX3/SPDIF_OUT | v190.5,142.88 v190.5,193.68
  Top 0.2: IC1.1 143.51,67.36 v143.51,71.75
  Bottom 0.2: v143.51,71.75 v190.5,71.75 | v190.5,135.25 v190.5,142.88 | v190.5,193.68 190.5,199.39 184.78,205.1 v182.25,205.1
GND  (via drill 0.35)
  Top 0.152: IC1.12 143.56,50.85 v143.51,50.8 | IC5.12 143.56,96.47 v144.15,95.89 | IC3.12 v139.06,144.15 | LED9.K 177.8,184.15 v178.44,184.78 | v180.23,185.94 184.04,185.94 184.78,186.69 U$1.GND1 | IC2.12 142.29,19.05 R7.1
  Top 0.2: IC4.12 v139.06,162.56
  Bottom 0.152: v178.44,184.78 179.07,185.42 180.34,185.42 180.34,185.83 v180.23,185.94
  pour Bottom (isolate 0.406): 0,0 0,205 arc-90 5,210 193,210 arc-90 198,205 198,4.98 arc-90 193.02,-0.02
IN_SEG_A
  Top 0.152: R16.2 7.62,136.53 9.53,134.62 20.32,134.62 D0.7 20.32,139.06 24.77,139.06 24.77,134.62 36.83,134.62 D1.7 36.83,139.06 41.27,139.06 41.27,134.62 53.34,134.62 D2.7 53.34,139.06 57.78,139.06 57.78,134.62 69.85,134.62 D3.7 69.85,139.06 74.3,139.06 74.3,134.62 86.36,134.62 | 90.81,134.62 102.87,134.62 D5.7 102.87,139.06 107.31,139.06 107.31,134.62 119.38,134.62 D6.7 119.38,139.06 123.83,139.06 123.83,134.62 135.89,134.62 D7.7 135.89,139.06 142.24,139.06 142.24,135.25 142.88,134.62 147.32,130.18 161.93,130.18 166.37,134.62 D8.7 | D9.7 180.97,134.62 172.72,134.62 172.72,139.06 166.37,139.06
  Top 0.2: 86.36,134.62 D4.7 86.36,139.06 90.81,139.06 90.81,134.62 | 166.37,139.06 D8.7
IN_SEG_B
  Top 0.152: 22.86,133.99 8.89,133.99 6.99,135.89 6.99,158.75 | 6.99,170.18 6.99,187.96 12.7,193.68 R17.2 | 22.86,133.99 39.37,133.99 | D0.6 22.86,133.99 | D1.6 39.37,133.99 | 39.37,133.99 55.88,133.99 | 55.88,133.99 D2.6 | 55.88,133.99 72.39,133.99 | 72.39,133.99 D3.6 | 72.39,133.99 88.9,133.99 105.41,133.99 | 105.41,133.99 D5.6 | 105.41,133.99 121.92,133.99 | 121.92,133.99 D6.6 | 138.43,133.99 121.92,133.99 | 142.24,133.99 146.69,129.54 163.83,129.54 168.28,133.99 168.91,133.99 | D8.6 168.91,133.99 | D9.6 182.88,133.99 168.91,133.99
  Top 0.2: 6.99,158.75 6.35,159.38 6.35,169.54 6.99,170.18 | D4.6 88.9,133.99 | D7.6 138.43,133.99 142.24,133.99
IN_SEG_C
  Top 0.152: R18.2 19.68,118.11 20.32,118.75 D0.4 20.32,123.83 27.3,123.83 27.3,119.38 36.83,119.38 | 36.83,123.83 43.81,123.83 43.81,119.38 53.34,119.38 D2.4 53.34,123.83 60.33,123.83 60.33,119.38 69.85,119.38 D3.4 69.85,123.83 76.83,123.83 76.83,119.38 86.36,119.38 D4.4 86.36,123.83 93.34,123.83 93.34,119.38 102.87,119.38 D5.4 102.87,123.83 109.86,123.83 109.86,119.38 119.38,119.38 D6.4 119.38,123.83 126.36,123.83 126.36,119.38 135.89,119.38 D7.4 135.89,123.83 155.57,123.83 155.57,119.38 166.37,119.38 D8.4 166.37,123.83 173.35,123.83 173.35,119.38 182.88,119.38 D9.4
  Top 0.2: 36.83,119.38 D1.4 36.83,123.83
IN_SEG_D
  Top 0.152: 15.24,120.65 14.61,120.02 10.16,120.02 6.99,123.19 R19.2 | D0.2 15.24,127 27.94,127 27.94,120.02 31.75,120.02 D1.2 31.75,127 44.45,127 44.45,120.02 48.26,120.02 D2.2 48.26,127 60.96,127 60.96,120.02 64.77,120.02 D3.2 64.77,127 77.47,127 77.47,120.02 81.28,120.02 D4.2 81.28,127 93.98,127 93.98,120.02 97.79,120.02 D5.2 97.79,127 110.49,127 110.49,120.02 114.3,120.02 D6.2 114.3,127 127,127 127,120.02 130.81,120.02 D7.2 130.81,127 156.84,127 156.84,120.02 161.29,120.02 D8.2 161.29,127 173.99,127 173.99,120.02 177.8,120.02 D9.2
  Top 0.2: D0.2 15.24,120.65
IN_SEG_E
  Top 0.152: R20.2 9.53,123.19 10.79,121.92 D0.1 12.7,127.64 29.21,127.64 | D1.1 29.21,127.64 | 29.21,127.64 45.72,127.64 | 45.72,127.64 D2.1 | 45.72,127.64 62.23,127.64 | 62.23,127.64 D3.1 | D4.1 78.74,127.64 | 62.23,127.64 78.74,127.64 | 78.74,127.64 95.25,127.64 | 95.25,127.64 D5.1 | 95.25,127.64 111.76,127.64 | 111.76,127.64 D6.1 | D7.1 128.27,127.64 | 111.76,127.64 128.27,127.64 | 128.27,127.64 158.75,127.64 | 158.75,127.64 D8.1 | 158.75,127.64 175.26,127.64 D9.1
IN_SEG_F
  Top 0.152: R21.2 8.89,136.53 10.16,135.25 14.61,135.25 15.24,135.89 D0.9 15.24,139.7 27.3,139.7 27.3,135.25 31.75,135.25 D1.9 31.75,139.7 43.81,139.7 43.81,135.25 48.26,135.25 D2.9 48.26,139.7 60.33,139.7 60.33,135.25 64.77,135.25 D3.9 64.77,139.7 76.83,139.7 76.83,135.25 81.28,135.25 D4.9 81.28,139.7 93.34,139.7 | 93.34,135.25 97.79,135.25 D5.9 97.79,139.7 109.86,139.7 109.86,135.25 114.3,135.25 D6.9 114.3,139.7 125.73,139.7 125.73,135.25 130.81,135.25 D7.9 130.81,139.7 142.88,139.7 142.88,135.89 143.51,135.25 147.96,130.81 161.29,130.81 161.29,135.25 D8.9 161.29,139.7 173.35,139.7 173.35,135.25 177.8,135.25 D9.9
  Top 0.2: 93.34,135.25 93.34,139.7
IN_SEG_G
  Top 0.152: 29.21,140.34 12.7,140.34 D0.10 10.79,137.16 10.16,137.79 R22.2 | 29.21,140.34 D1.10 | D2.10 45.72,140.34 | 29.21,140.34 45.72,140.34 | 45.72,140.34 62.23,140.34 | 62.23,140.34 D3.10 | D4.10 78.74,140.34 | 78.74,140.34 62.23,140.34 | 78.74,140.34 95.25,140.34 | 95.25,140.34 D5.10 | 95.25,140.34 111.76,140.34 | 111.76,140.34 D6.10 | 111.76,140.34 128.27,140.34 | 128.27,140.34 D7.10 | 128.27,140.34 130.18,142.24 149.86,142.24 151.76,140.34 158.75,140.34 | D8.10 158.75,140.34 | 158.75,140.34 175.26,140.34 D9.10
IN_SEG_P
  Top 0.152: R23.2 21.59,115.57 22.86,116.84 | 22.86,116.84 D0.5 | D1.5 39.37,116.84 | 39.37,116.84 22.86,116.84 | 39.37,116.84 55.88,116.84 D2.5 | 72.39,116.84 88.9,116.84 | 88.9,116.84 D4.5 | 88.9,116.84 105.41,116.84 | 105.41,116.84 D5.5 | 105.41,116.84 121.92,116.84 | 121.92,116.84 D6.5 | 121.92,116.84 138.43,116.84 | D7.5 138.43,116.84 | 138.43,116.84 168.91,116.84 | D8.5 168.91,116.84 | 168.91,116.84 185.42,116.84 D9.5
  Top 0.2: 55.88,116.84 72.39,116.84 D3.5
LED0  (via drill 0.35)
  Top 0.152: v165.74,180.97 141.6,180.97 137.16,177.16 26.02,177.16 24.13,179.06 R40.2
  Bottom 0.152: U$1.0-RX1/CS1/CRX2 182.25,180.97 v165.74,180.97
LED1  (via drill 0.35)
  Top 0.152: v164.47,181.61 141.6,181.61 137.16,177.8 44.45,177.8 40.64,181.61 R39.2
  Bottom 0.152: U$1.1-TX1/MISO1/CTX2 181.61,185.42 181.61,181.61 v164.47,181.61
LED2
  Top 0.152: R41.2 57.15,182.25 60.96,178.44 135.89,178.44 137.79,180.34 137.79,189.23 131.44,195.58 U$1.35-TX8
LED3  (via drill 0.35)
  Top 0.152: R42.2 73.66,182.25 76.83,179.07 v135.25,179.07 | v142.24,182.22 153.01,182.22 154.31,183.51 U$1.11-MOSI/CTX1
  Bottom 0.152: v135.25,179.07 138.43,182.25 142.24,182.25 v142.24,182.22
LED4  (via drill 0.35)
  Top 0.152: R43.2 90.17,181.61 92.08,179.71 134.62,179.71 v135.89,180.97 | U$1.12-MISO/MQSL 151.76,184.15 150.5,182.88 v144.15,182.88
  Bottom 0.152: v135.89,180.97 137.79,182.88 v144.15,182.88
LED5  (via drill 0.35)
  Top 0.152: R44.2 v107.95,187.96 | v107.95,192.41 v121.28,192.41 v121.28,192.4 | v127.64,192.41 v130.18,194.94 | v133.99,196.22 149.86,196.22 151.76,198.12 U$1.13-SCK/LED
  Bottom 0.152: v107.95,187.96 v107.95,192.41 | v121.28,192.4 v127.63,192.4 v127.64,192.41 | v130.18,194.94 131.44,196.22 v133.99,196.22
LED6
  Top 0.152: R45.2 126.36,184.15 U$1.32-OUT1B
LED7
  Top 0.152: R46.2 121.28,197.49 U$1.33-MCLK2
LED8
  Bottom 0.152: R47.2 154.31,198.75 136.53,198.75 133.99,201.29 U$1.36-PWM
LED9  (via drill 0.35)
  Top 0.152: v147.32,197.49 146.05,198.75 137.16,198.75 136.53,199.39 U$1.37-PWM | v157.48,194.94 159.38,196.85 v173.35,196.85 | v179.07,196.85 184.07,196.85 184.15,196.93 191.69,196.93 v194.31,194.31
  Bottom 0.152: v147.32,197.49 151.76,197.49 154.31,194.94 v157.48,194.94 | v173.35,196.85 v179.07,196.85 | v194.31,194.31 194.31,184.15 193.04,182.88 R48.2
N$1
  Top 0.152: S0.2 10.72,25.32 8.89,23.5 8.94,15.19 15.88,7.62 184.75,7.62 186.69,9.53 186.69,59.69 181.61,64.77 IC1.22
N$2
  Top 0.152: M1.2 176.51,25.13 176.53,25.4 159.24,45.87 143.51,45.72 140.97,48.26 140.97,55.88 142.24,57.15 IC1.9
N$3
  Top 0.152: M0.2 160.08,37.39 153.08,44.41 152.4,45.09 142.88,45.09 140.35,47.61 140.34,55.87 140.34,56.52 142.24,58.42 IC1.8
N$4  (via drill 0.35)
  Top 0.152: IC2.9 v146.05,24.77 | v151.79,24.77 151.79,19.02 156.21,14.61 180.34,14.61 182.25,16.51 182.25,18.21 SW9.4
  Bottom 0.152: v146.05,24.77 v151.79,24.77
N$5
  Top 0.152: IC1.7 133.99,59.69 129.54,55.24 129.54,32.37 S7.2
N$6
  Top 0.152: S6.2 113.09,56.58 117.47,60.96 IC1.6
N$7
  Top 0.152: IC1.5 106.05,62.23 96.52,52.7 96.52,24.75 S5.2
N$8
  Top 0.152: S4.2 80.07,52.13 91.44,63.5 IC1.4
N$9
  Top 0.152: IC1.3 73.66,64.77 63.5,54.61 63.56,54.55 S3.2
N$10
  Top 0.152: S2.2 47.05,49.59 63.5,66.04 IC1.2
N$11
  Top 0.152: S1.2 28.42,27.84 12.69,27.93 8.26,23.5 8.26,15.47 15.89,6.99 184.78,6.99 187.32,9.53 187.32,59.69 181.61,65.41 155.57,65.41 154.94,66.04 IC1.23
N$12  (via drill 0.35)
  Top 0.152: v152.4,26.04 152.4,19.05 155.57,15.88 164.47,15.88 166.09,17.5 SW8.4 | IC2.8 v146.08,26.04
  Bottom 0.152: v146.08,26.04 v152.4,26.04
N$13
  Top 0.152: IC2.7 146.05,27.3 146.69,26.67 146.69,18.41 144.78,16.51 135.89,16.51 135.61,16.79 SW7.4
N$14
  Top 0.152: IC2.6 146.05,28.57 147.32,27.3 147.32,18.41 144.78,15.88 118.75,15.88 118.11,16.51 118.11,17.5 SW6.4
N$15
  Top 0.152: IC2.5 145.41,29.84 147.96,27.3 147.96,18.41 144.78,15.24 105.21,15.24 102.59,17.86 SW5.4
N$16  (via drill 0.35)
  Top 0.152: P0_9.2 180.34,144.15 177.16,140.97 152.4,140.97 v150.5,142.88 | v148.59,144.78 145.41,147.96 IC3.9
  Bottom 0.152: v150.5,142.88 v148.59,144.78
N$17
  Top 0.152: SW3.4 69.57,17.22 72.82,13.97 144.78,13.97 149.22,18.41 149.22,28.57 145.41,32.38 IC2.3
N$18
  Top 0.152: IC2.2 146.69,33.66 149.86,30.48 149.86,18.41 140.97,9.53 52.07,9.53 50.8,10.79 50.8,16.87 SW2.4
N$19
  Top 0.152: SW1.4 35,18.49 34.29,17.78 34.29,11.43 36.83,8.89 140.97,8.89 150.5,18.41 150.5,32.38 151.76,33.66 IC2.23
N$20
  Top 0.152: IC2.22 152.4,32.38 151.13,31.11 151.13,18.41 140.97,8.26 20.95,8.26 17.78,11.43 17.78,16.23 SW0.4
N$21
  Bottom 0.2: SW0.3 22.3,11.99 R1.2
N$22
  Bottom 0.2: SW1.3 38.81,11.99 R2.2
N$23  (via drill 0.35)
  Top 0.152: P0_8.2 163.81,144.13 161.93,141.6 153.03,141.6 v151.76,142.88 | v148.59,146.05 145.41,149.22 IC3.8
  Bottom 0.152: v151.76,142.88 v148.59,146.05
N$24
  Bottom 0.2: SW2.3 55.32,11.99 R3.2
N$25
  Top 0.152: P0_7.2 133.35,147.96 133.99,148.59 140.97,148.59 142.88,150.5
  Top 0.406: 142.88,150.5 IC3.7
N$26
  Bottom 0.2: SW3.3 71.83,11.99 R4.2
N$27
  Top 0.152: P0_6.2 116.84,149.22 118.11,150.5 140.97,150.5 142.24,151.76 IC3.6
N$28
  Bottom 0.152: R5.2 103.15,11.43 SW5.3
N$29
  Top 0.152: 142.88,153.03 142.24,153.03 140.34,151.13 103.5,151.13 100.33,147.32 P0_5.2
  Top 0.406: IC3.5 142.88,153.03
N$30
  Bottom 0.2: SW6.3 121.36,11.99 R6.2
N$31
  Top 0.152: P0_4.2 83.82,152.85 87.74,156.77 140.34,156.76 142.79,154.31
  Top 0.406: IC3.4 142.79,154.31
N$32
  Bottom 0.2: SW7.3 137.87,11.99 R7.2
N$33
  Top 0.152: IC3.3 142.55,155.57 140.8,157.33 71.78,157.33 67.31,152.85 P0_3.2
N$34
  Bottom 0.2: SW8.3 168.35,11.99 R8.2
N$35
  Top 0.152: P0_2.2 50.8,153.74 54.54,158.12 140.97,158.12 142.24,156.84 IC3.2
N$36
  Bottom 0.2: SW9.3 183.59,11.35 R9.2
N$37
  Top 0.152: IC2.4 145.41,31.11 148.59,27.94 148.59,18.41 144.78,14.61 88.27,14.61 86.08,16.79 SW4.4
N$38
  Bottom 0.2: SW4.3 88.34,11.99 R10.2
N$39
  Top 0.152: IC3.23 151.13,156.84 149.86,155.57 149.86,144.78 148.59,143.51 130.18,143.51 129.54,142.88 36.81,142.88 P0_1.2
N$40
  Top 0.152: IC3.22 151.13,155.57 150.42,154.86 150.42,144.55 148.75,142.88 130.18,142.88 129.54,142.24 21.57,142.24 P0_0.2
N$41
  Top 0.152: 177.18,160.66 152.4,160.66 149.22,163.83 149.22,165.74 148.59,166.37 IC4.9
  Top 0.2: P1_9.2 177.18,160.66
N$42
  Top 0.152: P1_8.2 163.83,162.56 162.57,161.29 152.4,161.29 149.86,163.83 149.86,167 149.22,167.64 IC4.8
N$43
  Top 0.152: P1_7.2 133.35,165.74 133.99,166.37 138.43,166.37 142.24,168.91
  Top 0.2: IC4.7 142.24,168.91
N$44
  Top 0.152: 142.88,170.18 138.43,167 130.81,167 128.27,164.47 121.92,164.47 119.38,167 117.47,167 116.84,166.37 P1_6.2
  Top 0.2: IC4.6 142.88,170.18
N$45
  Top 0.152: P1_5.2 100.33,166.37 101.6,167.64 120.02,167.64 122.56,165.1 127.64,165.1 130.18,167.64 137.79,167.64 141.6,170.18 141.6,170.81 142.24,171.45 IC4.5
N$46
  Top 0.152: IC4.4 141.64,172.72 141.26,173.1 140.59,173.74 140.34,173.99 86.36,173.99
  Top 0.2: 86.36,173.99 83.82,171.45 P1_4.2
N$47
  Top 0.152: P1_3.2 67.31,171.45 70.48,174.62 140.97,174.62 141.6,173.99 IC4.3
N$48
  Top 0.152: IC4.2 54.61,175.26 50.8,171.45 P1_2.2
N$49
  Top 0.152: P1_1.2 34.92,172.09 38.73,175.9 140.34,175.9 142.88,178.44 154.31,178.44 154.94,178.44 156.21,177.16 156.21,176.53 156.21,175.26 IC4.23
N$50
  Top 0.152: IC4.22 156.84,173.99 156.84,177.8 155.86,178.79 141.96,178.79 139.7,176.53 123.19,176.53 38.59,176.25 35.7,173.35 20.32,173.35 17.78,170.81 P1_0.2
N$51
  Bottom 0.2: R11.2 T1.2
N$52
  Bottom 0.2: T2.2 R12.2
N$53
  Top 0.152: 144.78,100.97 145.41,100.97 146.69,102.23 146.69,108.58 152.4,114.3 180.77,114.3 MS9.4
  Top 0.2: 144.78,100.97 IC5.9
N$54
  Bottom 0.2: T3.2 R13.2
N$55
  Bottom 0.2: T4.2 R14.2
N$56
  Bottom 0.152: T5.2 R15.2
N$57
  Top 0.152: IC5.8 142.24,102.23 141.6,101.6 141.6,100.97 142.24,100.33 146.05,100.33 147.32,101.6 147.32,108.58 152.4,113.67 165.1,113.67 166.09,112.67 MS8.4
N$58
  Top 0.152: MS7.4 138.56,111.2 142.37,108.03 144.7,108.03 145.41,107.31 145.41,104.14 144.78,103.5 IC5.7
N$59
  Top 0.152: MS6.4 119.18,111.12 120.65,111.12 124.73,107.57 124.89,107.31 139.06,107.31 142.88,104.78 IC5.6
N$60
  Top 0.152: MS5.4 104.42,113.03 123.19,113.03 127.64,108.58 139.06,108.58 142.24,106.05 IC5.5
N$61
  Top 0.152: MS3.4 69.57,112.12 69.85,112.39 69.85,113.67 70.48,114.3 135.89,114.3 142.88,108.58 IC5.3
N$62
  Top 0.152: IC5.2 142.24,109.86 136.53,114.94 56.52,114.94 53.06,111.48 MS2.4
N$63
  Top 0.152: MS1.4 44.88,102.87 124.46,102.87 128.27,99.06 139.06,99.06 140.97,97.16 142.88,95.25 143.51,94.61 147.32,94.61 148.59,95.89 148.59,108.58 149.86,109.86 IC5.23
N$64
  Bottom 0.2: R24.2 T6.2
N$65
  Bottom 0.2: T7.2 R25.2
N$66
  Bottom 0.2: T8.2 R26.2
N$67
  Bottom 0.2: R27.2 T9.2
N$68
  Bottom 0.2: T10.2 R28.2
N$69
  Top 0.152: MS0.4 29.01,102.23 124.03,102.23 128.14,98.12 139.54,98.12 143.35,94.31 147.45,94.31 148.9,95.76 148.9,108.25 149.22,108.58 IC5.22
N$70
  Bottom 0.2: MS0.3 21.59,103.15 R29.2
N$71
  Bottom 0.2: MS1.3 38.1,103.15 R30.2
N$72
  Bottom 0.2: MS2.3 54.61,103.15 R31.2
N$73
  Bottom 0.2: MS3.3 71.12,103.15 R32.2
N$74
  Bottom 0.2: MS5.3 104.14,103.15 R33.2
N$75
  Bottom 0.2: MS6.3 120.65,103.15 R34.2
N$76
  Bottom 0.2: MS7.3 137.16,103.15 R35.2
N$77
  Bottom 0.2: MS8.3 167.64,103.15 R36.2
N$78
  Bottom 0.2: MS9.3 184.15,103.15 R37.2
N$79
  Top 0.152: IC5.4 142.24,107.31 139.7,109.22 128.27,109.22 123.83,113.67 88.54,113.67 MS4.4
N$80
  Bottom 0.2: MS4.3 87.63,103.15 R38.2
N$81
  Bottom 0.152: LED2.A R41.1
N$82
  Bottom 0.152: LED0.A R40.1
N$83
  Bottom 0.152: LED3.A R42.1
N$84
  Bottom 0.152: LED1.A R39.1
N$85
  Bottom 0.152: LED4.A R43.1
N$86
  Bottom 0.152: R44.1 LED5.A
N$87
  Top 0.152: LED6.A 115.57,181.61 116.2,180.97 120.02,180.97 120.65,181.61 R45.1
N$88
  Top 0.152: LED7.A 129.54,180.34 115.57,180.34 113.67,182.25 113.67,186.06 114.94,187.32 R46.1
N$89
  Top 0.152: LED8.A 158.12,182.88 155.57,185.42 R47.1
N$90
  Top 0.152: LED9.A 175.26,180.97 175.9,180.34 179.07,180.34 179.71,180.97 R48.1
POT0_INH  (via drill 0.35)
  Top 0.152: IC3.15 158.12,146.69 163.19,151.76 163.19,156.21 167,160.02 186.06,160.02 188.59,161.93 v188.59,177.8
  Bottom 0.152: v188.59,177.8 163.83,177.8 162.56,179.07 162.56,186.69 U$1.8-TX2/IN1
POT0_X  (via drill 0.35)
  Top 0.152: v159.38,198.12 U$1.16-A2/RX4/SCL1
  Top 0.2: IC3.1 143.56,161.24 v143.51,161.29
  Bottom 0.152: 148.59,180.34 150.5,183.51 150.5,190.5 151.13,191.13 158.75,191.13 159.38,191.77
  Bottom 0.2: v143.51,161.29 146.05,161.29 148.59,163.83 148.59,180.34 | 159.38,191.77 v159.38,198.12
POT1_INH  (via drill 0.35)
  Top 0.152: IC4.15 151.76,165.1 151.13,165.74 v151.13,177.16
  Bottom 0.152: v151.13,177.16 U$1.9-OUT1C
POT1_X  (via drill 0.35)
  Top 0.152: v147.96,189.23 149.86,191.13 v161.93,191.13 | v161.93,198.12 U$1.17-A3/TX4/SDA1
  Top 0.2: IC4.1 143.51,176.58 v143.51,177.8
  Bottom 0.2: v143.51,177.8 143.51,180.34 144.15,180.97 146.69,180.97 147.96,182.25 v147.96,189.23 | v161.93,191.13 v161.93,198.12
SEG_A
  Top 0.152: R16.1 7.62,184.78 29.21,205.74 138.43,205.74 140.34,205.74 141.6,204.47 U$1.39-A15/CS/OUT1A
SEG_B
  Top 0.152: R17.1 15.88,206.38 142.24,206.38 144.15,204.47 U$1.40-A16/CS1
SEG_C
  Top 0.152: R18.1 3.81,123.19 3.81,196.85 13.97,207.01 144.15,207.01 146.69,204.47 U$1.41-A17/MISO1
SEG_D  (via drill 0.35)
  Top 0.152: R19.1 5.71,132.72 5.71,158.75 | v19.68,189.87 130.18,189.87 | 5.08,159.38 v5.08,189.87
  Top 0.2: 130.18,189.87 131.44,188.59 U$1.30-CRX3 | 5.71,158.75 5.08,159.38
  Bottom 0.2: v5.08,189.87 v19.68,189.87
SEG_E  (via drill 0.35)
  Top 0.152: v18.41,189.23 128.27,189.23 | R20.1 6.35,134.62 6.35,158.75 | 6.35,170.81 v6.35,189.23
  Top 0.2: 128.27,189.23 128.91,188.59 U$1.31-CTX3 | 6.35,158.75 5.71,159.38 5.71,170.18 6.03,170.5 | 6.03,170.5 6.35,170.81 | 6.03,170.5
  Bottom 0.2: v6.35,189.23 v18.41,189.23
SEG_F
  Top 0.152: R21.1 8.89,184.15 15.88,191.13 133.99,191.13
  Top 0.2: 133.99,191.13 136.53,188.59 U$1.28-RX7
SEG_G
  Top 0.152: 10.16,184.15 16.51,190.5 132.08,190.5
  Top 0.2: R22.1 10.16,184.15 | 132.08,190.5 133.99,188.59 U$1.29-TX7
SEG_K0  (via drill 0.35)
  Top 0.152: v26.04,146.69 v26.04,170.81
  Bottom 0.2: R11.1 v26.04,146.69 | v26.04,170.81 26.04,187.32 45.09,206.38 167,206.38 U$1.19-A5/SCL0
SEG_K1  (via drill 0.35)
  Top 0.152: v42.55,146.69 v42.55,172.72
  Top 0.2: v164.47,205.1 167,205.1 U$1.20-A6/TX5/LRCLK1
  Bottom 0.2: R12.1 v42.55,146.69 | v42.55,172.72 42.55,186.69 60.96,205.1 v164.47,205.1
SEG_K1AA
  Bottom 0.2: D1.8 D1.3 34.29,119.38 35.56,118.11 T2.3
SEG_K1AAAAV
  Bottom 0.2: D6.8 D6.3 116.84,120.65 119.38,118.11 T7.3
SEG_K2  (via drill 0.35)
  Top 0.152: v59.05,147.32 v59.05,156.84 | v59.05,165.74 v59.05,172.72
  Bottom 0.2: R13.1 v59.05,147.32 | v59.05,156.84 v59.05,165.74 | v59.05,172.72 59.05,187.32 76.2,204.47 164.47,204.47 165.74,203.2 165.74,201.93 166.37,201.29 170.81,201.29 U$1.21-A7/RX5/BCLK1
SEG_K2AA
  Bottom 0.2: D2.8 D2.3 50.8,120.65 53.34,118.11 T3.3
SEG_K2VVV
  Bottom 0.2: D7.8 D7.3 133.35,120.65 135.89,118.11 T8.3
SEG_K3  (via drill 0.35)
  Top 0.152: v75.56,147.32 v75.56,156.21 | v151.13,193.68 172.09,193.68 174.62,196.22 U$1.22-A8/CTX1
  Top 0.2: v75.56,165.74 v75.56,172.72
  Bottom 0.2: R14.1 v75.56,147.32 | v75.56,156.21 v75.56,165.74 | v75.56,172.72 75.56,187.32 87.63,199.39 133.35,199.39 137.79,193.68 v151.13,193.68
SEG_K3AA
  Bottom 0.2: D3.8 D3.3 67.31,120.65 69.85,118.11 T4.3
SEG_K3VVV
  Bottom 0.2: D8.8 D8.3 163.83,120.65 166.37,118.11 T9.3
SEG_K4  (via drill 0.35)
  Top 0.152: v92.08,147.32 v92.08,155.57 | v92.08,165.74 v92.08,172.09 | 177.16,198.12 172.09,193.04 143.25,193.04
  Top 0.2: v141.48,191.26 143.25,193.04 | 177.16,198.12 U$1.23-A9/CRX1/MCLK1
  Bottom 0.2: R15.1 v92.08,147.32 | v92.08,155.57 v92.08,165.74 | v92.08,172.09 92.08,187.96 97.79,193.68 128.91,193.68 131.44,191.13 140.97,191.13 v141.48,191.26
SEG_K4AA
  Bottom 0.2: D4.8 D4.3 83.82,120.65 86.36,118.11 T5.3
SEG_K4VDF
  Bottom 0.2: D9.8 D9.3 180.34,120.65 182.88,118.11 T10.3
SEG_K5  (via drill 0.35)
  Top 0.152: v108.58,147.32 v108.58,150.4 | v108.58,161.29 104.78,161.29 97.16,161.29 95.89,162.56 95.89,166.37 97.79,168.28 107.95,168.28 108.58,168.91 v108.58,172.72
  Bottom 0.2: R24.1 v108.58,147.32 | v108.58,150.4 v108.58,161.29 | v108.58,172.72 108.58,184.15 113.03,188.59 146.05,188.59 146.69,187.96 U$1.24-A10/TX6/SCL2
SEG_K6  (via drill 0.35)
  Top 0.152: v125.09,145.41 v125.09,149.86 | v125.09,166.37 v125.09,172.72
  Top 0.2: v144.15,185.42 U$1.25-A11/RX6/SDA2
  Bottom 0.2: R25.1 v125.09,145.41 | v125.09,149.86 v125.09,166.37 | v144.15,185.42 128.27,185.42 125.09,182.88 v125.09,172.72
SEG_K7  (via drill 0.35)
  Top 0.152: R26.1 145.41,128.91 163.83,128.91 166.37,131.44 | v189.23,141.6 189.23,180.34 | 186.69,191.77 146.05,191.77
  Top 0.2: 166.37,131.44 v189.23,131.44 | 189.23,180.34 189.23,180.97 189.23,189.87 186.69,191.77 | 146.05,191.77 U$1.26-A12/MOSI1
  Bottom 0.2: v189.23,131.44 v189.23,141.6
SEG_K8
  Top 0.152: 184.15,132.72 194.31,144.15 194.31,192.41 193.04,194.31 189.23,194.31 187.32,192.41 144.15,192.41
  Top 0.2: R27.1 184.15,132.72 | 144.15,192.41 U$1.27-A13/SCK1
SEG_K9
  Top 0.152: R28.1 195.58,143.51 195.58,195.58 184.78,206.38 148.59,206.38 147.96,205.74 147.96,201.29 146.69,200.03 141.6,200.03 U$1.38-A14/CS/IN1
SEG_P  (via drill 0.35)
  Top 0.152: R23.1 8.89,115.57 2.54,121.92 v2.54,191.77 | v19.68,191.77 121.92,191.77 128.91,198.75 U$1.34-RX8
  Bottom 0.2: v2.54,191.77 v19.68,191.77
SIG_K0AA
  Bottom 0.2: T1.3 19.68,118.11 17.78,120.02 D0.3 D0.8
SIG_K1AA
  Bottom 0.2: D5.8 D5.3 100.33,120.65 102.87,118.11 T6.3
SWITCH2_INH  (via drill 0.35)
  Top 0.152: IC5.15 152.4,99.69 v151.76,100.33 | v151.76,134.62 151.76,136.53 v154.31,139.06 | v162.56,156.21 v162.56,159.38 | v158.75,185.42 U$1.10-CS\MQSR
  Bottom 0.152: v151.76,100.33 v151.76,134.62 | v154.31,139.06 159.38,144.15 159.38,149.22 159.38,149.86 162.56,153.03 v162.56,156.21 | v162.56,159.38 162.56,160.02 159.38,163.19 159.38,167 161.93,169.54 161.93,173.35 160.02,175.26 160.02,179.07 160.66,179.71 160.66,180.97 160.02,181.61 159.38,181.61 157.48,181.61 156.84,182.88 v158.75,185.42
SWITCH_INH  (via drill 0.35)
  Top 0.152: v192.41,22.23 v192.41,137.79 | v192.41,145.41 v192.41,188.59
  Top 0.2: IC2.15 v156.21,23.5
  Bottom 0.2: v156.21,23.5 157.48,23.5 158.75,22.23 v192.41,22.23 | v192.41,137.79 v192.41,145.41 | v192.41,188.59 165.1,188.59 164.47,187.96 U$1.7-RX2/OUT1A
SWITCH_X  (via drill 0.35)
  Top 0.152: v193.04,55.88 v193.04,139.06 | v193.04,146.69 v193.04,191.13
  Top 0.2: IC2.1 144.2,36.14 v144.15,36.2
  Bottom 0.2: v144.15,36.2 146.69,38.73 151.76,38.73 166.37,55.88 v193.04,55.88 | v193.04,139.06 v193.04,146.69 | v193.04,191.13 182.25,191.13 179.07,194.31 167.64,194.31 161.93,200.03 157.48,200.03 156.84,200.66 U$1.15-A1/RX3/SPDIF_IN

### Text on the board
tNames: NOMIDIx3x10x10b | RALF BAECKER 2020 | ~ | 0 | 1 | 2 | 3 | 4 | 5 | 6 | 7 | 8 | 9